# EAGLE design Baropodometro_V3 (EAGLE 9.6.0)

## Sheet 1 of 4
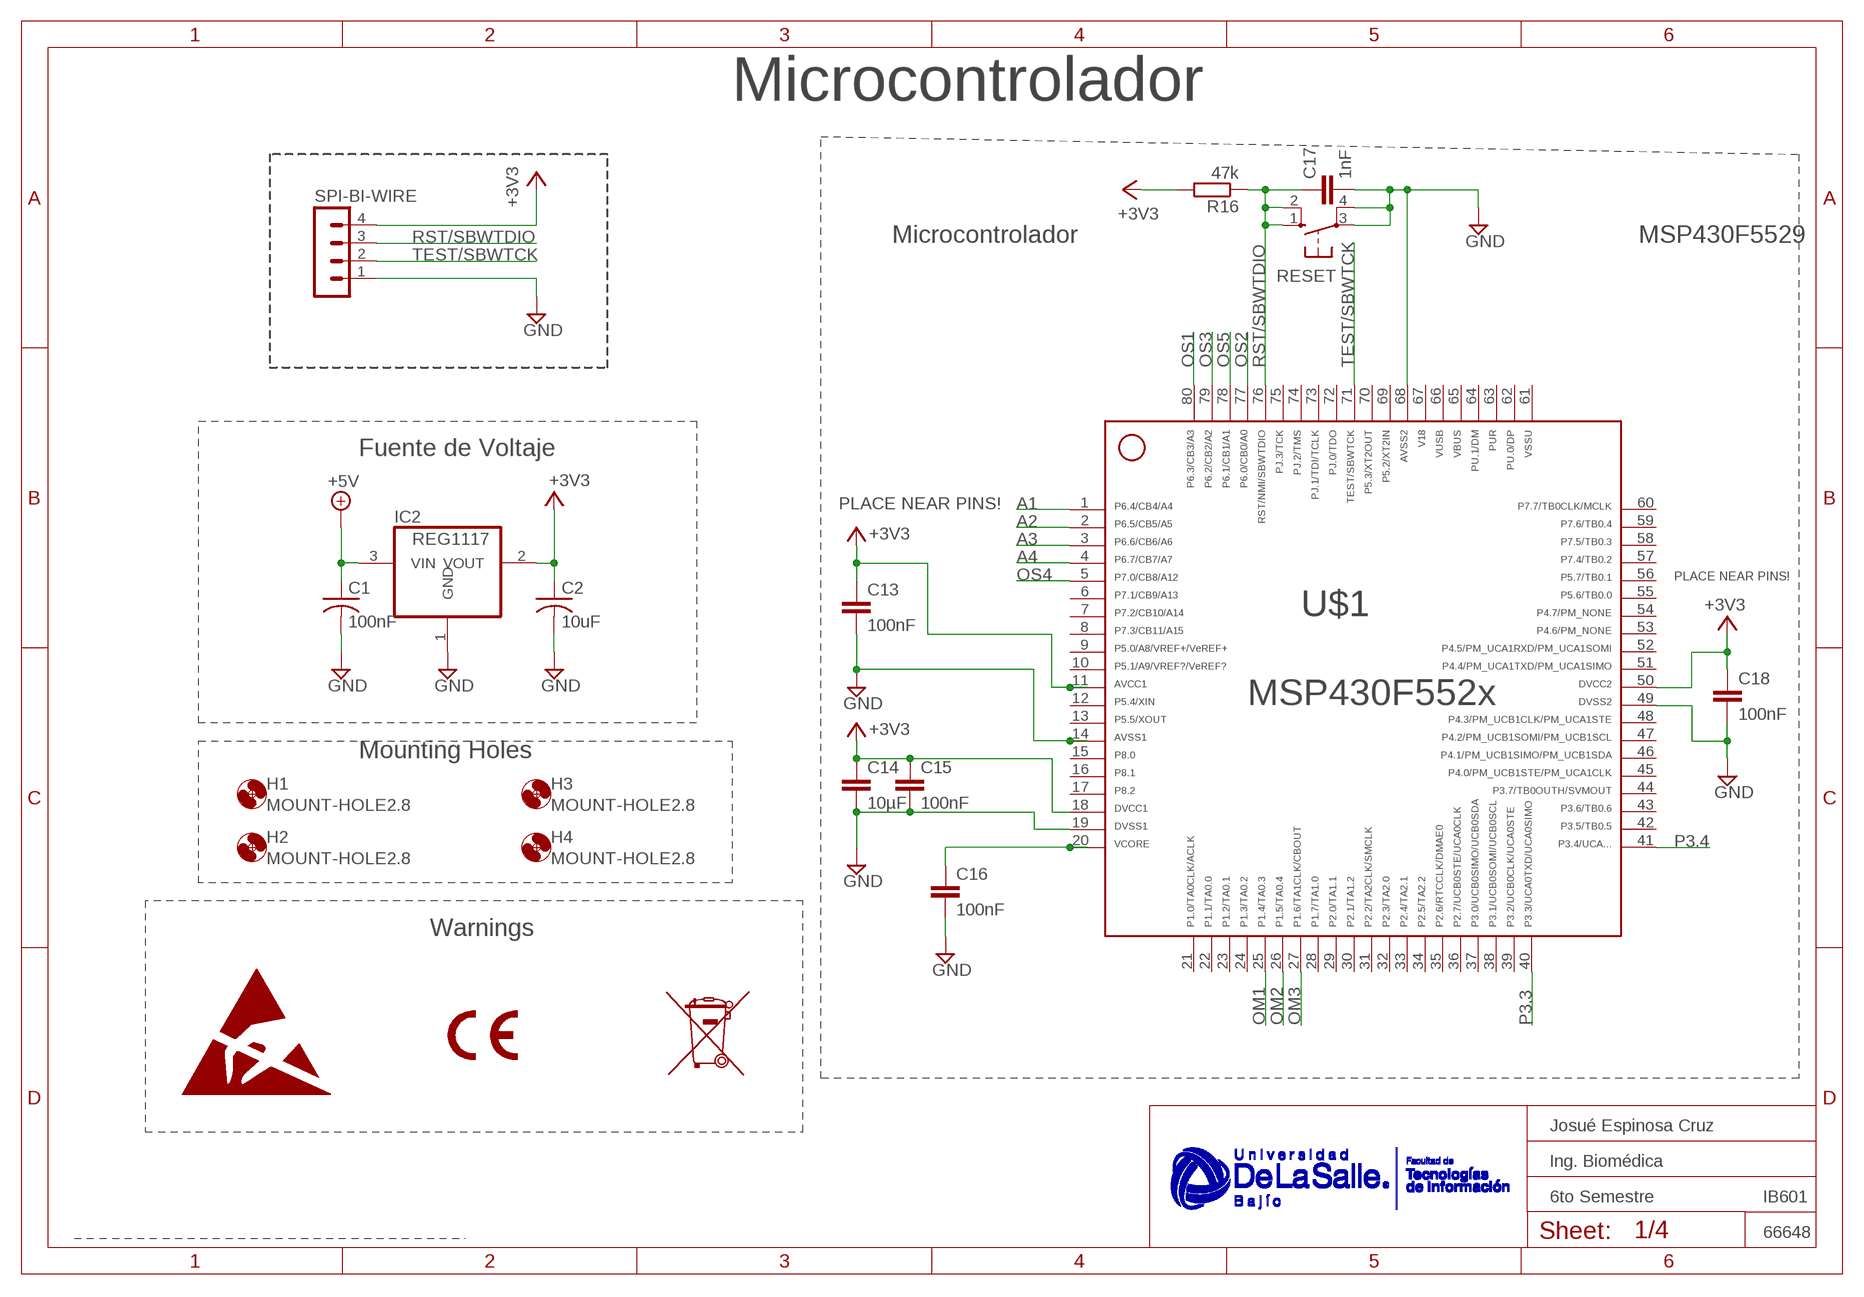
[diagram p0: schematic, sheet 1]

### Parts
C1  100nF  C-USC0805  [C0805]
C2  10uF  C-USC0805  [C0805]
C13  100nF  C-EUC0805  [C0805]
C14  10µF  C-EUC0805  [C0805]
C15  100nF  C-EUC0805  [C0805]
C16  100nF  C-EUC0805  [C0805]
C17  1nF  C-EUC0805  [C0805]
C18  100nF  C-EUC0805  [C0805]
H1  MOUNT-HOLE2.8  [2,8]
H2  MOUNT-HOLE2.8  [2,8]
H3  MOUNT-HOLE2.8  [2,8]
H4  MOUNT-HOLE2.8  [2,8]
IC2  REG1117  [SOT223]
R16  47k  R-EU_R0805  [R0805]
RESET  10-XX  [B3F-10XX]
SPI-BI-WIRE  MA04-1  [MA04-1]
U$1  MSP430F5529  TI_MSP430_V16_INTERN_F552X---PN80  [TI_MSP430_V16_INTERN_PN80]

### Nets
+3V3: C2.1 C13.1 C14.1 C15.1 C18.1 IC2.2(VOUT) R16.2 SPI-BI-WIRE.4 U$1.11 U$1.18 U$1.50 ; also sheet 2,3
+5V: C1.1 IC2.3(VIN) ; also sheet 4
A1: U$1.1 ; also sheet 3
A2: U$1.2 ; also sheet 3
A3: U$1.3 ; also sheet 3
A4: U$1.4 ; also sheet 3
GND: C1.2 C2.2 C13.2 C14.2 C15.2 C16.2 C17.2 C18.2 IC2.1(GND) RESET.3(P) RESET.4(P1) SPI-BI-WIRE.1 U$1.14 U$1.19 U$1.49 U$1.68 ; also sheet 2,3,4
N$5: C16.1 U$1.20
OM1: U$1.25 ; also sheet 3
OM2: U$1.26 ; also sheet 3
OM3: U$1.27 ; also sheet 3
OS1: U$1.80 ; also sheet 2
OS2: U$1.77 ; also sheet 2
OS3: U$1.79 ; also sheet 2
OS4: U$1.5 ; also sheet 2
OS5: U$1.78 ; also sheet 2
P3.3: U$1.40 ; also sheet 4
P3.4: U$1.41 ; also sheet 4
RST/SBWTDIO: C17.1 R16.1 RESET.1(S) RESET.2(S1) SPI-BI-WIRE.3 U$1.76
TEST/SBWTCK: SPI-BI-WIRE.2 U$1.71
Unconnected: U$1.6 U$1.7 U$1.8 U$1.9 U$1.10 U$1.12 U$1.13 U$1.15 U$1.16 U$1.17 U$1.21 U$1.22 U$1.23 U$1.24 U$1.28 U$1.29 U$1.30 U$1.31 U$1.32 U$1.33 U$1.34 U$1.35 U$1.36 U$1.37 U$1.38 U$1.39 U$1.42 U$1.43 U$1.44 U$1.45 U$1.46 U$1.47 U$1.48 U$1.51 U$1.52 U$1.53 U$1.54 U$1.55 U$1.56 U$1.57 U$1.58 U$1.59 U$1.60 U$1.62 U$1.63 U$1.64 U$1.69 U$1.70 U$1.72 U$1.73 U$1.74 U$1.75

### Notes on the sheet
- Microcontrolador
- Microcontrolador | MSP430F5529
- Fuente de Voltaje
- PLACE NEAR PINS!
- PLACE NEAR PINS!
- Mounting Holes
- Warnings

## Sheet 2 of 4
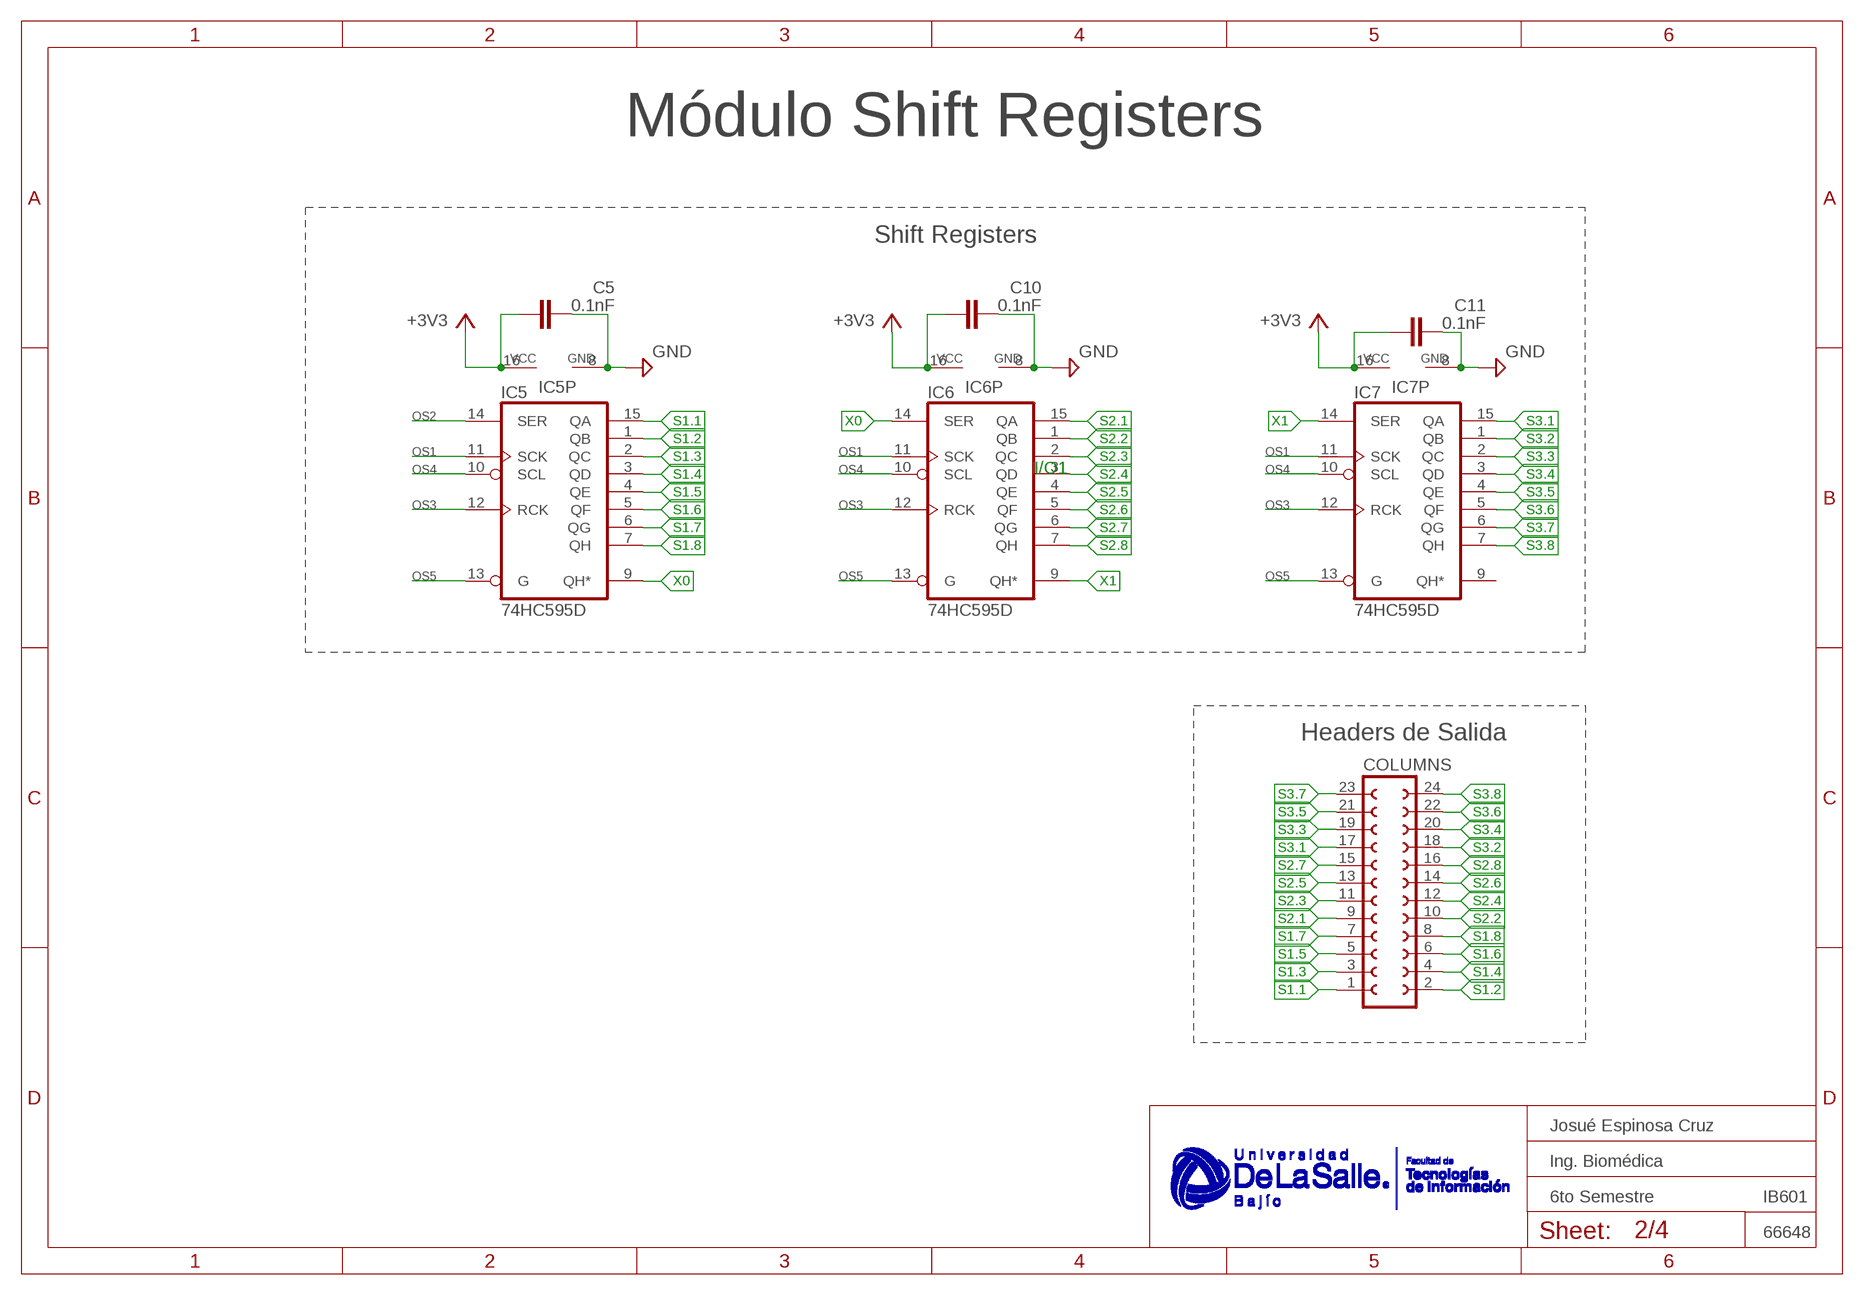
[diagram p1: schematic, sheet 2]

### Parts
C5  0.1nF  C-EUC0805  [C0805]
C10  0.1nF  C-EUC0805  [C0805]
C11  0.1nF  C-EUC0805  [C0805]
COLUMNS  FE12-2W  [FE12-2W]
IC5  74HC595D  [SO16]
IC6  74HC595D  [SO16]
IC7  74HC595D  [SO16]

### Nets
+3V3: C5.1 C10.1 C11.1 IC5.16(VCC) IC6.16(VCC) IC7.16(VCC) ; also sheet 1,3
GND: C5.2 C10.2 C11.2 IC5.8(GND) IC6.8(GND) IC7.8(GND) ; also sheet 1,3,4
OS1: IC5.11(SCK) IC6.11(SCK) IC7.11(SCK) ; also sheet 1
OS2: IC5.14(SER) ; also sheet 1
OS3: IC5.12(RCK) IC6.12(RCK) IC7.12(RCK) ; also sheet 1
OS4: IC5.10(SCL) IC6.10(SCL) IC7.10(SCL) ; also sheet 1
OS5: IC5.13(G) IC6.13(G) IC7.13(G) ; also sheet 1
S1.1: COLUMNS.1 IC5.15(QA)
S1.2: COLUMNS.2 IC5.1(QB)
S1.3: COLUMNS.3 IC5.2(QC)
S1.4: COLUMNS.4 IC5.3(QD)
S1.5: COLUMNS.5 IC5.4(QE)
S1.6: COLUMNS.6 IC5.5(QF)
S1.7: COLUMNS.7 IC5.6(QG)
S1.8: COLUMNS.8 IC5.7(QH)
S2.1: COLUMNS.9 IC6.15(QA)
S2.2: COLUMNS.10 IC6.1(QB)
S2.3: COLUMNS.11 IC6.2(QC)
S2.4: COLUMNS.12 IC6.3(QD)
S2.5: COLUMNS.13 IC6.4(QE)
S2.6: COLUMNS.14 IC6.5(QF)
S2.7: COLUMNS.15 IC6.6(QG)
S2.8: COLUMNS.16 IC6.7(QH)
S3.1: COLUMNS.17 IC7.15(QA)
S3.2: COLUMNS.18 IC7.1(QB)
S3.3: COLUMNS.19 IC7.2(QC)
S3.4: COLUMNS.20 IC7.3(QD)
S3.5: COLUMNS.21 IC7.4(QE)
S3.6: COLUMNS.22 IC7.5(QF)
S3.7: COLUMNS.23 IC7.6(QG)
S3.8: COLUMNS.24 IC7.7(QH)
X0: IC5.9(QH*) IC6.14(SER)
X1: IC6.9(QH*) IC7.14(SER)
Unconnected: IC7.9(QH*)

### Notes on the sheet
- Módulo Shift Registers
- Shift Registers
- I/O1
- Headers de Salida

## Sheet 3 of 4
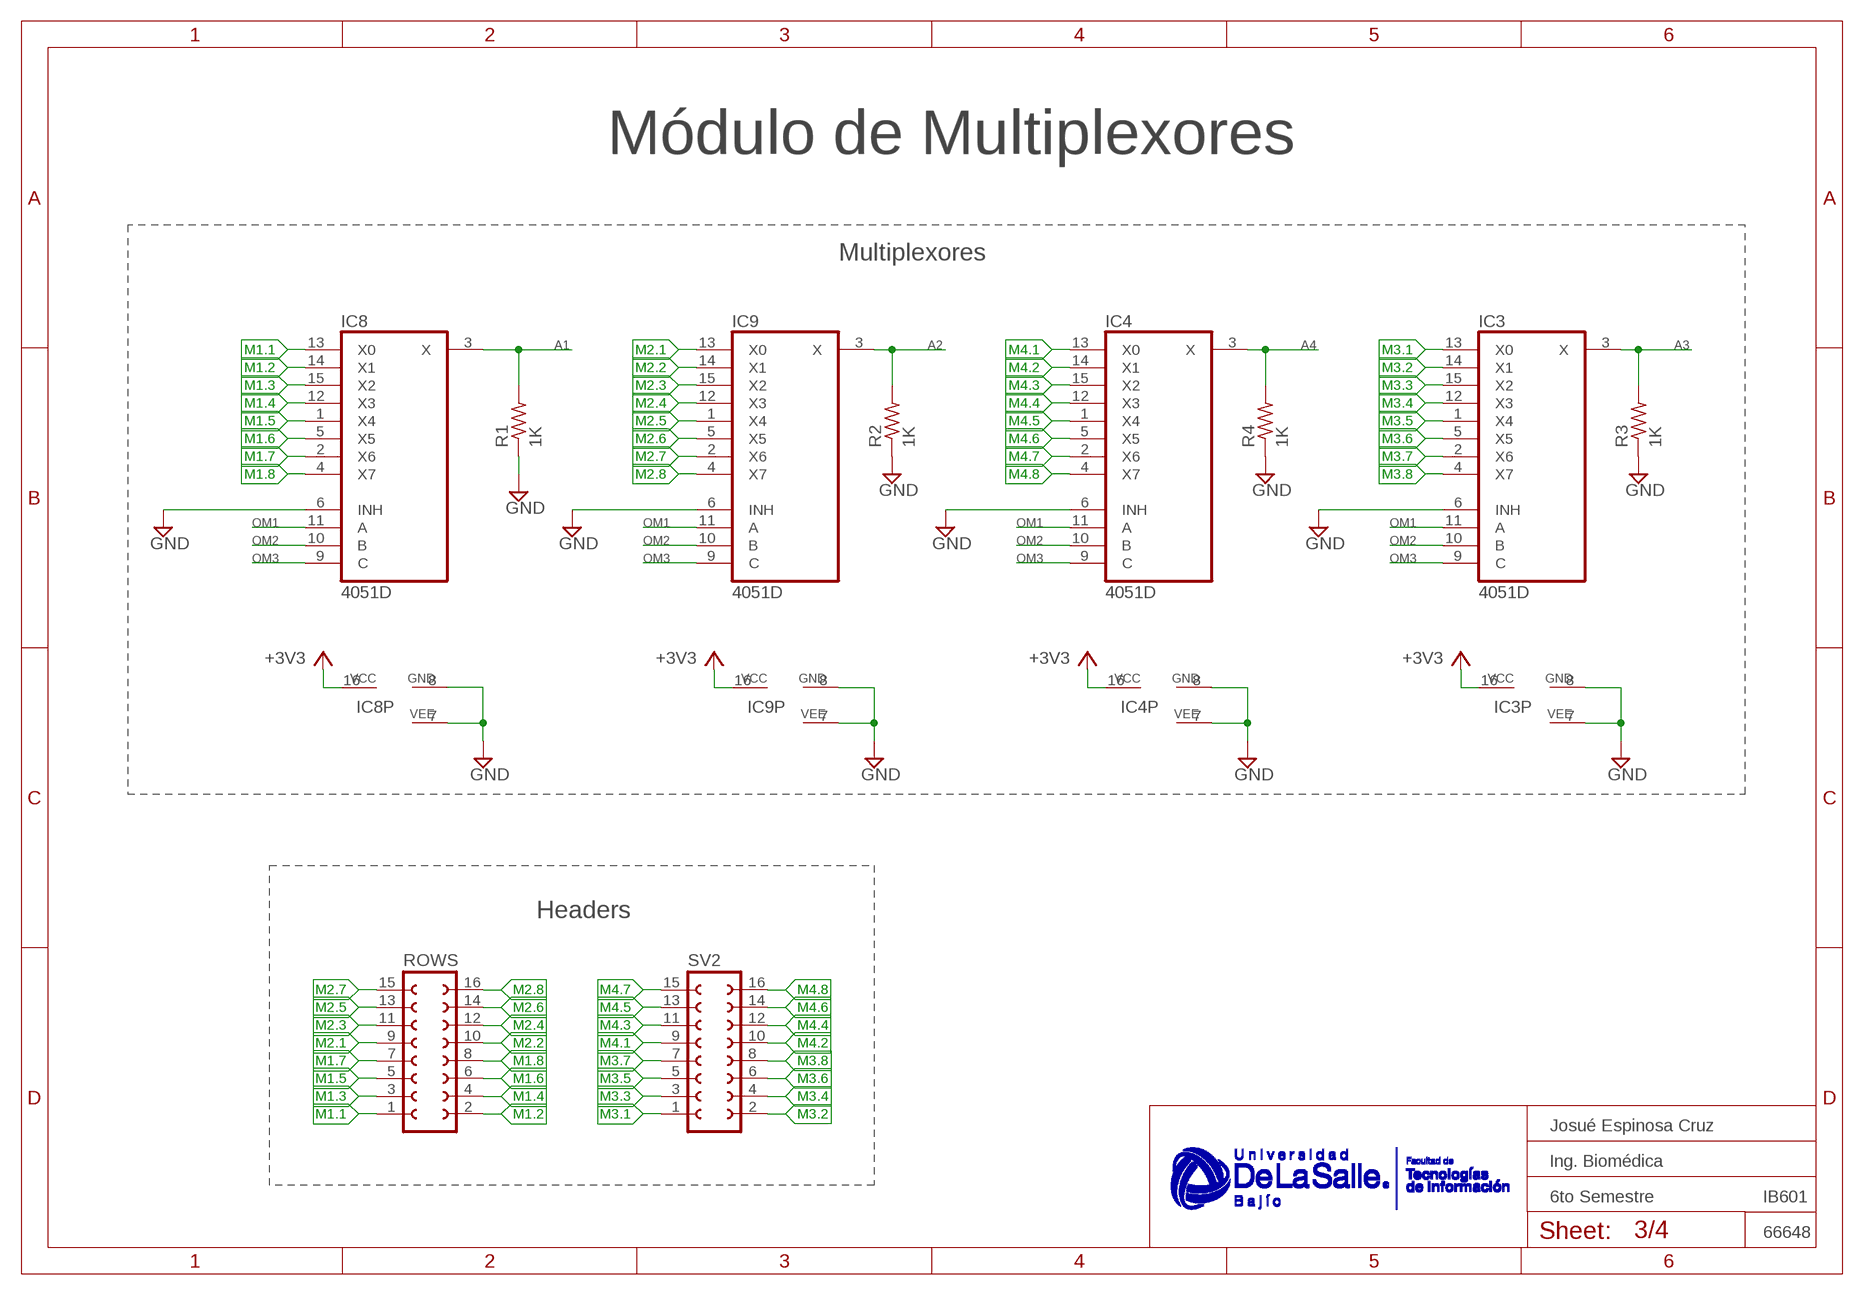
[diagram p2: schematic, sheet 3]

### Parts
IC3  4051D  [SO16]
IC4  4051D  [SO16]
IC8  4051D  [SO16]
IC9  4051D  [SO16]
R1  1K  R-US_R0805  [R0805]
R2  1K  R-US_R0805  [R0805]
R3  1K  R-US_R0805  [R0805]
R4  1K  R-US_R0805  [R0805]
ROWS  FE08-2W  [FE08-2W]
SV2  FE08-2W  [FE08-2W]

### Nets
+3V3: IC3.16(VCC) IC4.16(VCC) IC8.16(VCC) IC9.16(VCC) ; also sheet 1,2
A1: IC8.3(X) R1.2 ; also sheet 1
A2: IC9.3(X) R2.2 ; also sheet 1
A3: IC3.3(X) R3.2 ; also sheet 1
A4: IC4.3(X) R4.2 ; also sheet 1
GND: IC3.6(INH) IC3.7(VEE) IC3.8(GND) IC4.6(INH) IC4.7(VEE) IC4.8(GND) IC8.6(INH) IC8.7(VEE) IC8.8(GND) IC9.6(INH) IC9.7(VEE) IC9.8(GND) R1.1 R2.1 R3.1 R4.1 ; also sheet 1,2,4
M1.1: IC8.13(X0) ROWS.1
M1.2: IC8.14(X1) ROWS.2
M1.3: IC8.15(X2) ROWS.3
M1.4: IC8.12(X3) ROWS.4
M1.5: IC8.1(X4) ROWS.5
M1.6: IC8.5(X5) ROWS.6
M1.7: IC8.2(X6) ROWS.7
M1.8: IC8.4(X7) ROWS.8
M2.1: IC9.13(X0) ROWS.9
M2.2: IC9.14(X1) ROWS.10
M2.3: IC9.15(X2) ROWS.11
M2.4: IC9.12(X3) ROWS.12
M2.5: IC9.1(X4) ROWS.13
M2.6: IC9.5(X5) ROWS.14
M2.7: IC9.2(X6) ROWS.15
M2.8: IC9.4(X7) ROWS.16
M3.1: IC3.13(X0) SV2.1
M3.2: IC3.14(X1) SV2.2
M3.3: IC3.15(X2) SV2.3
M3.4: IC3.12(X3) SV2.4
M3.5: IC3.1(X4) SV2.5
M3.6: IC3.5(X5) SV2.6
M3.7: IC3.2(X6) SV2.7
M3.8: IC3.4(X7) SV2.8
M4.1: IC4.13(X0) SV2.9
M4.2: IC4.14(X1) SV2.10
M4.3: IC4.15(X2) SV2.11
M4.4: IC4.12(X3) SV2.12
M4.5: IC4.1(X4) SV2.13
M4.6: IC4.5(X5) SV2.14
M4.7: IC4.2(X6) SV2.15
M4.8: IC4.4(X7) SV2.16
OM1: IC3.11(A) IC4.11(A) IC8.11(A) IC9.11(A) ; also sheet 1
OM2: IC3.10(B) IC4.10(B) IC8.10(B) IC9.10(B) ; also sheet 1
OM3: IC3.9(C) IC4.9(C) IC8.9(C) IC9.9(C) ; also sheet 1

### Notes on the sheet
- Módulo de Multiplexores
- Multiplexores
- Headers

## Sheet 4 of 4
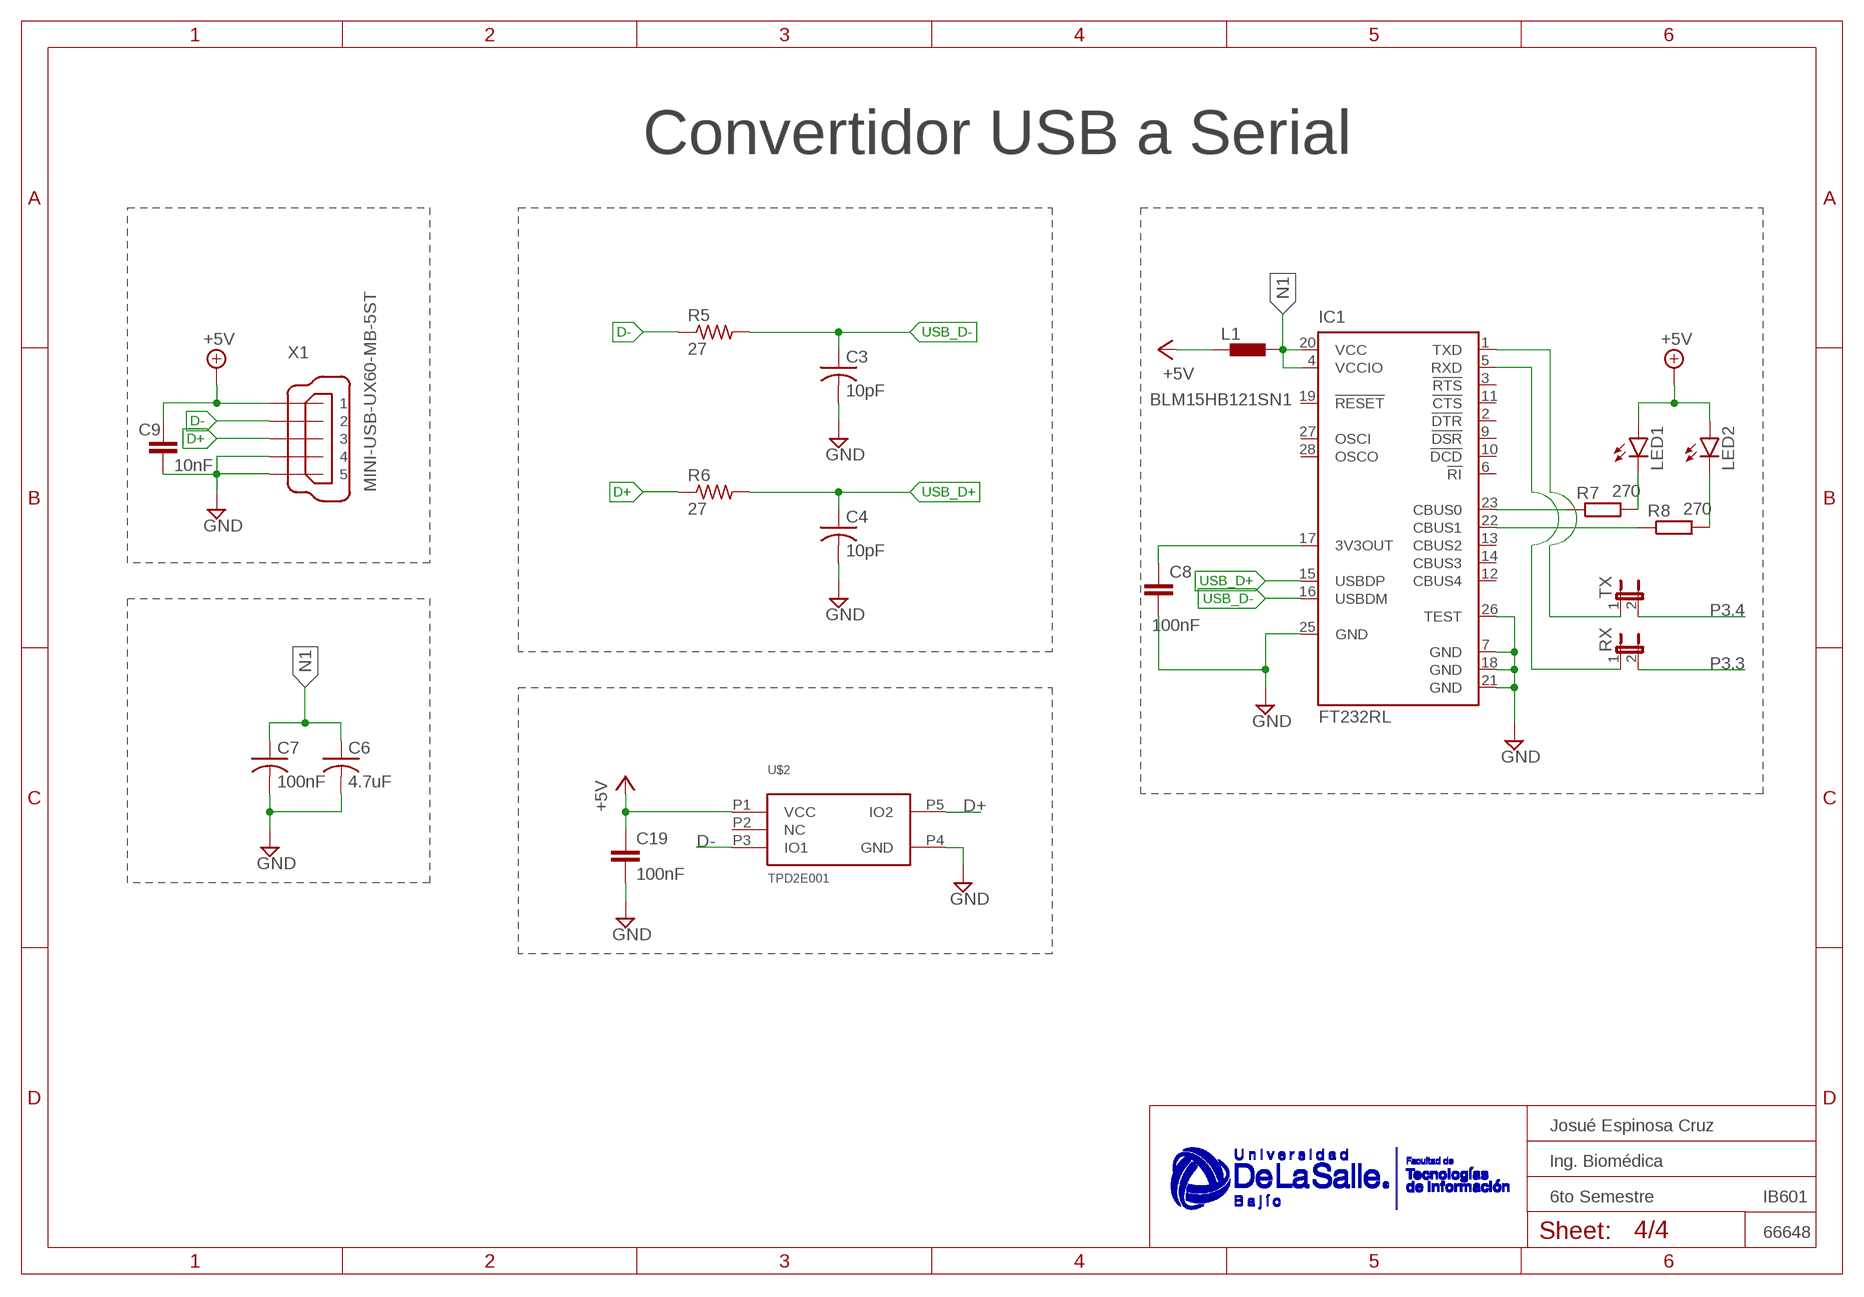
[diagram p3: schematic, sheet 4]

### Parts
C3  10pF  C-USC0805  [C0805]
C4  10pF  C-USC0805  [C0805]
C6  4.7uF  C-USC0805  [C0805]
C7  100nF  C-USC0805  [C0805]
C8  100nF  C-EUC0805  [C0805]
C9  10nF  C-EUC0805  [C0805]
C19  100nF  C-EUC0805  [C0805]
IC1  FT232RL  [SSOP28]
L1  BLM15HB121SN1  [0402]
LED1  LEDCHIP-LED0805  [CHIP-LED0805]
LED2  LEDCHIP-LED0805  [CHIP-LED0805]
R5  27  R-US_R0805  [R0805]
R6  27  R-US_R0805  [R0805]
R7  270  R-EU_R0805  [R0805]
R8  270  R-EU_R0805  [R0805]
RX  JP1E  [JP1]
TX  JP1E  [JP1]
U$2  TPD2E001  [SOT-5]
X1  MINI-USB-UX60-MB-5ST  [UX60-MB-5ST]

### Nets
+5V: C9.1 C19.1 L1.1 LED1.A LED2.A U$2.P1(VCC) X1.1 ; also sheet 1
D+: R6.1 U$2.P5(IO2) X1.3
D-: R5.1 U$2.P3(IO1) X1.2
GND: C3.2 C4.2 C6.2 C7.2 C8.2 C9.2 C19.2 IC1.7(GND) IC1.18(GND) IC1.21(GND) IC1.25(GND) IC1.26(TEST) U$2.P4(GND) X1.4 X1.5 ; also sheet 1,2,3
N1: C6.1 C7.1 IC1.4(VCCIO) IC1.20(VCC) L1.2
N$2: LED1.C R7.2
N$3: IC1.22(CBUS1) R8.1
N$6: IC1.23(CBUS0) R7.1
N$7: LED2.C R8.2
N$9: IC1.1(TXD) TX.1
N$10: IC1.5(RXD) RX.1
N$11: C8.1 IC1.17(3V3OUT)
P3.3: RX.2 ; also sheet 1
P3.4: TX.2 ; also sheet 1
USB_D+: C4.1 IC1.15(USBDP) R6.2
USB_D-: C3.1 IC1.16(USBDM) R5.2
Unconnected: IC1.2(!DTR) IC1.3(!RTS) IC1.6(!RI) IC1.9(!DSR) IC1.10(!DCD) IC1.11(!CTS) IC1.12(CBUS4) IC1.13(CBUS2) IC1.14(CBUS3) IC1.19(!RESET) IC1.27(OSCI) IC1.28(OSCO) U$2.P2(NC)

### Notes on the sheet
- Convertidor USB a Serial

## Power pins joined to a net without a drawn wire
61: U$1.61
65: U$1.65
66: U$1.66
67: U$1.67

## Library data of the parts
C1-C4 C6 C7 = rcl:C-US: CAPACITOR, American symbol; SPICEPREFIX: C
C5 C8-C11 C13-C19 = rcl:C-EU: CAPACITOR, European symbol; SPICEPREFIX: C
COLUMNS = Baropodometro:FE12-2W: FEMALE HEADER; OC_FARNELL: unknown; OC_NEWARK: unknown
H1-H4 = Baropodometro:MOUNT-HOLE: MOUNTING HOLE with drill center marker
IC1 = Baropodometro:FT232R: Source: http://www.ftdichip.com/Documents/DataSheets/DS_FT232R_v104.pdf; MPN: FT232RL; OC_FARNELL: 1146032; OC_NEWARK: 91K9918
IC2 = Baropodometro:REG1117: 800mA and 1A Low Dropout (LDO) Positive Regulator 1.8V, 2.5V, 2.85V, 3.3V, 5V, and Adj; MPN: REG1117; OC_FARNELL: 1097566; OC_NEWARK: 14P6981
IC3 IC4 IC8 IC9 = Baropodometro:4051: 8-channel ANALOG MULTIPLEXER
IC5-IC7 = Baropodometro:74*595: 8-bit SHIFT REGISTER, output latch
L1 = inductors:BLM15H: EMIFIL (R) Chip Ferrite Bead for GHz Noise Source: http://www.murata.com/ Ferrite Bead BLM15H.pdf
LED1 LED2 = led:LED: LED OSRAM: - CHIPLED LG R971, LG N971, LY N971, LG Q971, LY Q971, LO R971, LY R971 LH N974, LH R974 LS Q976, LO Q976, LY Q976 LO Q996 - Hyper CHIPLED LW Q18S LB Q993, LB Q99A, LB R99A - SideLED LS A670, LO A670, LY A670, LG A670, LP A670 LB A673, LV A673, LT A673, LW A673 LH A674 LY A675 LS A676, LA A676, LO A676, LY A676, LW A676 LS A679, LY A679, LG A679 - Hyper Micro SIDELED® LS Y876, LA Y876, LO Y876, LY Y876 LT Y87S - SmartLED LW L88C, LW L88S LB L89C, LB L89S, LG L890 LS L89K, LO L89K, LY L89K LS L896, LA L896, LO L896, LY L896 - TOPLED LS T670, LO T670, LY T670, LG T670, LP T670 LSG T670, LSP T670, LSY T670, LOP T670, LYG T670 LG T671, LOG T671, LSG T671 LB T673, LV T673, LT T673, LW T673 LH T674 LS T676, LA T676, LO T676, LY T676, LB T676, LH T676, LSB T676, LW T676 LB T67C, LV T67C, LT T67C, LS T67K, LO T67K, LY T67K, LW E67C LS E67B, LA E67B, LO E67B, LY E67B, LB E67C, LV E67C, LT E67C LW T67C LS T679, LY T679, LG T679 LS T770, LO T770, LY T770, LG T770, LP T770 LB T773, LV T773, LT T773, LW T773 LH T774 LS E675, LA E675, LY E675, LS T675 LS T776, LA T776, LO T776, LY T776, LB T776 LHGB T686 LT T68C, LB T68C - Hyper Mini TOPLED® LB M676 - Mini TOPLED Santana® LG M470 LS M47K, LO M47K, LY M47K Source: http://www.osram.convergy.de LUXEON: - LUMILED® LXK2-PW12-R00, LXK2-PW12-S00, LXK2-PW14-U00, LXK2-PW14-V00 LXK2-PM12-R00, LXK2-PM12-S00, LXK2-PM14-U00 LXK2-PE12-Q00, LXK2-PE12-R00, LXK2-PE12-S00, LXK2-PE14-T00, LXK2-PE14-U00 LXK2-PB12-K00, LXK2-PB12-L00, LXK2-PB12-M00, LXK2-PB14-N00, LXK2-PB14-P00, LXK2-PB14-Q00 LXK2-PR12-L00, LXK2-PR12-M00, LXK2-PR14-Q00, LXK2-PR14-R00 LXK2-PD12-Q00, LXK2-PD12-R00, LXK2-PD12-S00 LXK2-PH12-R00, LXK2-PH12-S00 LXK2-PL12-P00, LXK2-PL12-Q00, LXK2-PL12-R00 Source: www.luxeon.com KINGBRIGHT: KA-3528ASYC Source: www.kingbright.com
R1-R6 = rcl:R-US_: RESISTOR, American symbol; SPICEPREFIX: R
R7 R8 R16 = rcl:R-EU_: RESISTOR, European symbol; SPICEPREFIX: R
RESET = Baropodometro:10-XX: OMRON SWITCH; MPN: B3F-1000; OC_FARNELL: 176432; OC_NEWARK: 36M3542
ROWS SV2 = Baropodometro:FE08-2W: FEMALE HEADER; OC_FARNELL: unknown; OC_NEWARK: unknown
RX TX = Baropodometro:JP1E: JUMPER
SPI-BI-WIRE = Baropodometro:MA04-1: PIN HEADER; OC_FARNELL: unknown; OC_NEWARK: unknown
U$1 = Baropodometro:TI_MSP430_V16_INTERN_F552X---PN80: ***MSP430F552X***PN80 http://www.ti.com/lit/gpn/msp430f5529 Rev1.0 06/2010 For F552X where X is 1,5,7,9
U$2 = Baropodometro:TPD2E001
X1 = Baropodometro:MINI-USB-: MINI USB Connector Source: http://www.hirose.co.jp/cataloge_hp/e24000019.pdf; OC_FARNELL: unknown; OC_NEWARK: unknown

## Board
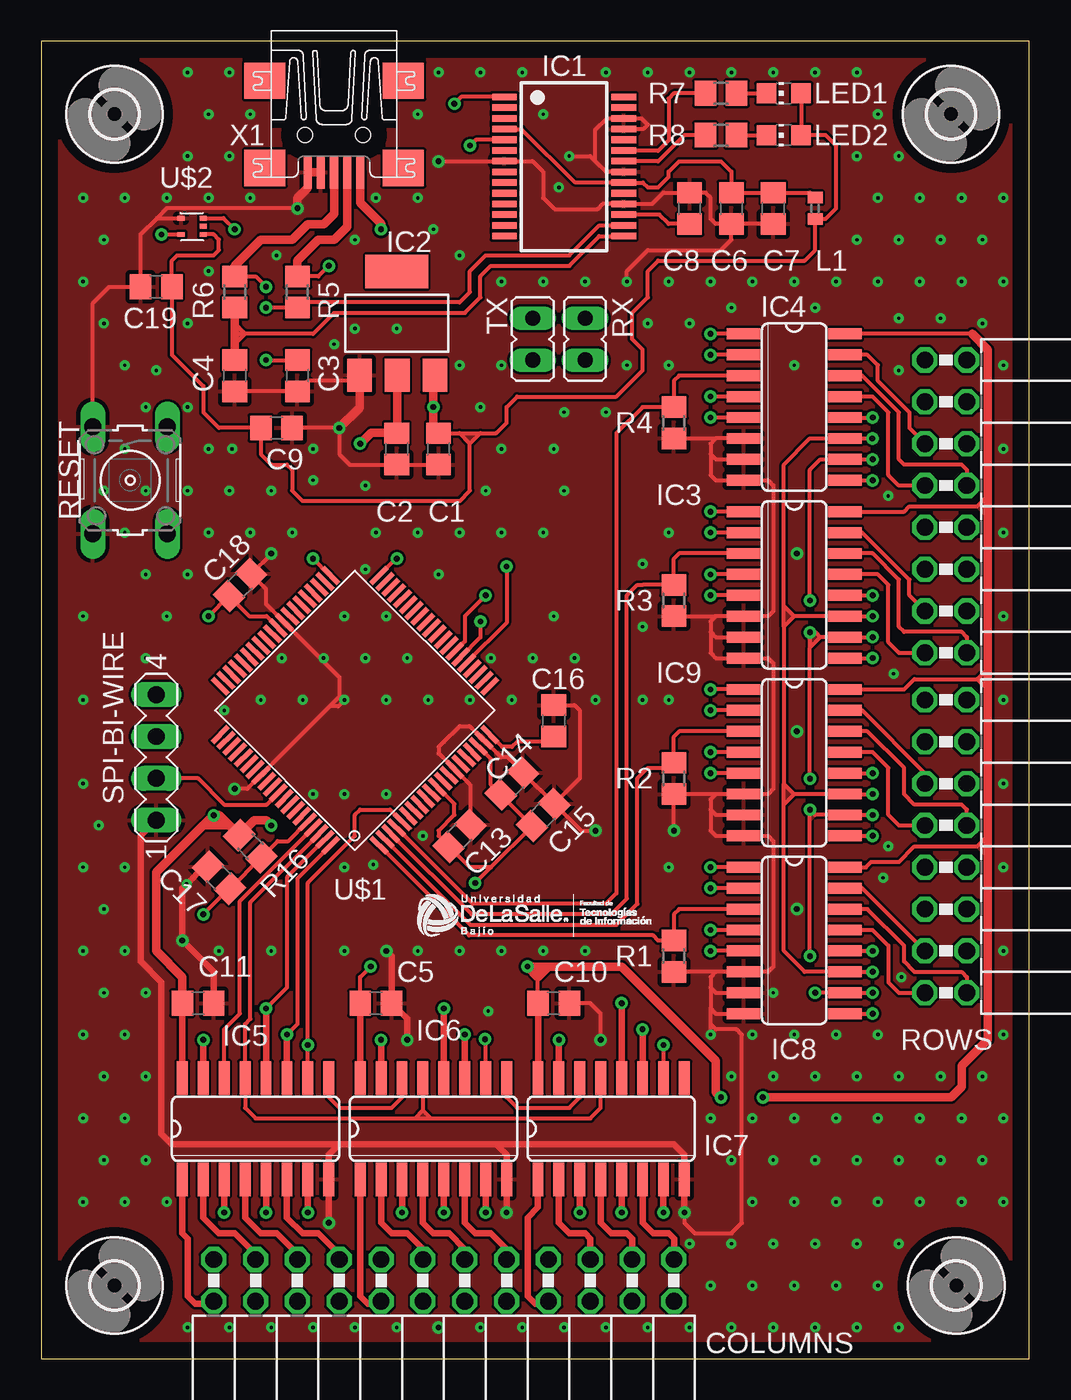
[diagram p4: board, top side]
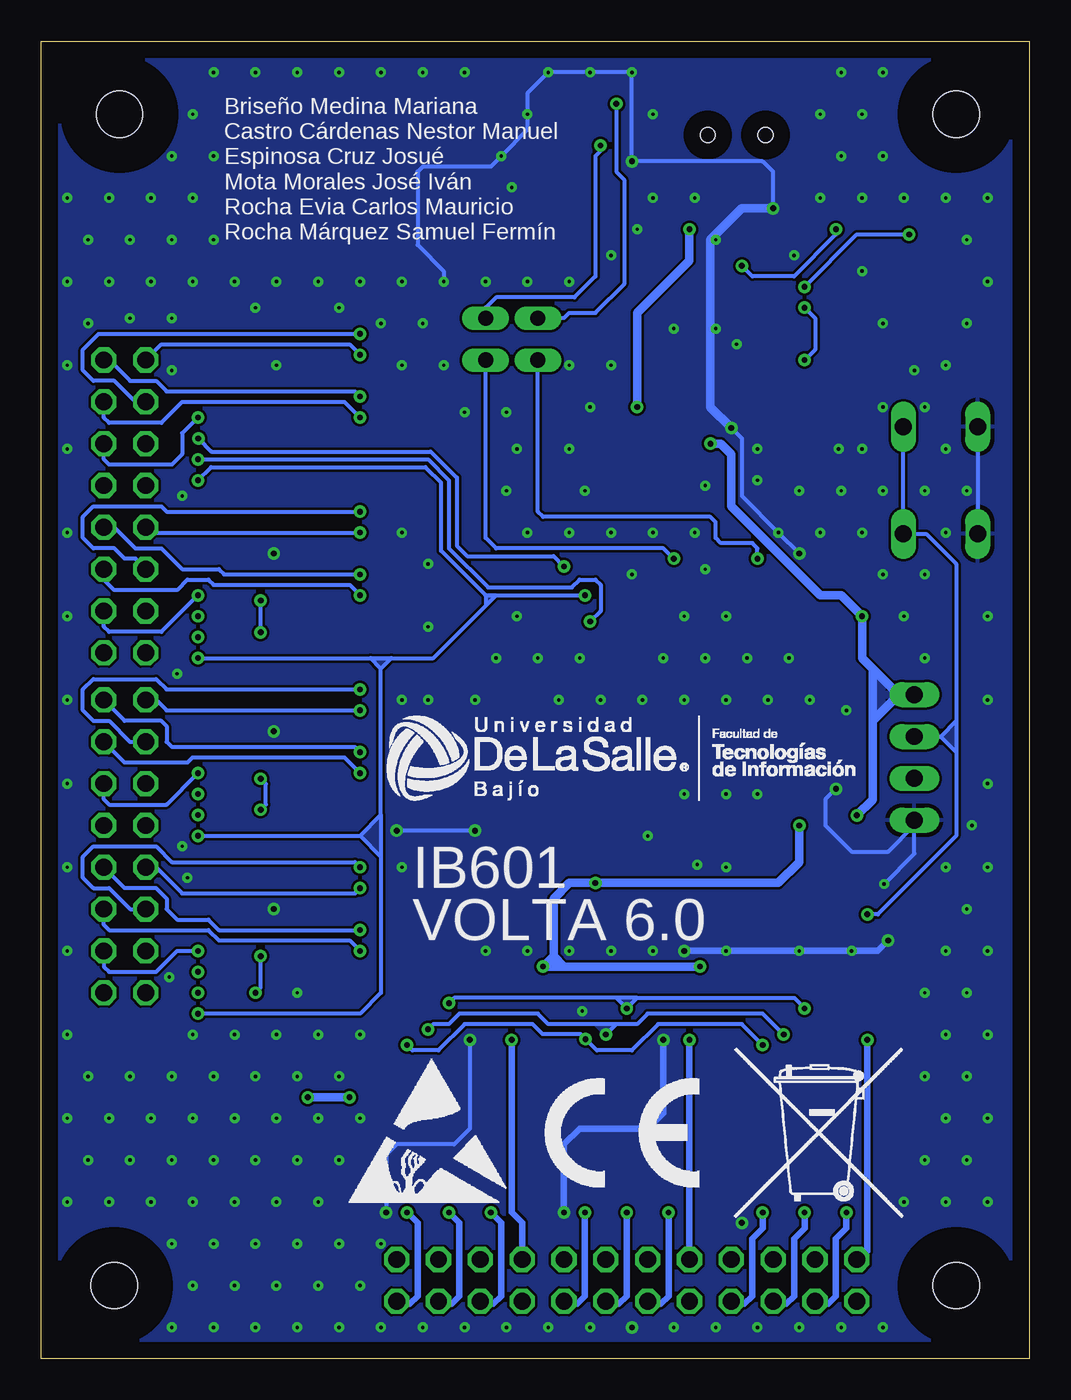
[diagram p5: board, bottom side, seen from below]

Size 60 x 80 mm. Coordinates in mm from the lower left corner, seen from the top.
Outline: 0,0 60,0 60,80 0,80 0,0
Copper layers (1*16): Top 0.035mm / dielectric 1.5mm / Bottom 0.035mm
Design rules "default *": minimum track width 6mil, minimum drill 0.2mm, track to track 6mil, track to pad 6mil, pad to pad 6mil, via to via 8mil, smd to smd 6mil, copper to edge 40mil, drill to drill 6mil, minimum pad ring 10mil, minimum via ring 8mil, stop-mask expansion 4mil, vias tented up to drill 0mil, thermal gap 10mil

### Footprints (pad centres in the part's own frame; a part is rotated, then mirrored left to right if it is on the bottom)
C0805 = smd 1.3 x 1.5: 1 -0.95,0; 2 0.95,0
FE12-2W = drill 1.016 octagon: 1 -13.97,1.27; 2 -13.97,-1.27; 3 -11.43,1.27; 4 -11.43,-1.27; 5 -8.89,1.27; 6 -8.89,-1.27; 7 -6.35,1.27; 8 -6.35,-1.27; 9 -3.81,1.27; 10 -3.81,-1.27; 11 -1.27,1.27; 12 -1.27,-1.27; 13 1.27,1.27; 14 1.27,-1.27; 15 3.81,1.27; 16 3.81,-1.27; 17 6.35,1.27; 18 6.35,-1.27; 19 8.89,1.27; 20 8.89,-1.27; 21 11.43,1.27; 22 11.43,-1.27; 23 13.97,1.27; 24 13.97,-1.27
2,8 = hole 2.8: 0,0
SSOP28 = smd 0.4 x 1.5: 1 -4.225,-3.625; 2 -3.575,-3.625; 3 -2.925,-3.625; 4 -2.275,-3.625; 5 -1.625,-3.625; 6 -0.975,-3.625; 7 -0.325,-3.625; 8 0.325,-3.625; 9 0.975,-3.625; 10 1.625,-3.625; 11 2.275,-3.625; 12 2.925,-3.625; 13 3.575,-3.625; 14 4.225,-3.625; 15 4.225,3.625; 16 3.575,3.625; 17 2.925,3.625; 18 2.275,3.625; 19 1.625,3.625; 20 0.975,3.625; 21 0.325,3.625; 22 -0.325,3.625; 23 -0.975,3.625; 24 -1.625,3.625; 25 -2.275,3.625; 26 -2.925,3.625; 27 -3.575,3.625; 28 -4.225,3.625
SOT223 = smd 1.499 x 2.007: 1 -2.261,-3.15; 2 0.025,-3.15; 3 2.311,-3.15 | smd 3.81 x 2.007: 4 0,3.15
SO16 = smd 0.66 x 2.032: 1 -4.445,-3.073; 2 -3.175,-3.073; 3 -1.905,-3.073; 4 -0.635,-3.073; 5 0.635,-3.073; 6 1.905,-3.073; 7 3.175,-3.073; 8 4.445,-3.073; 9 4.445,3.073; 10 3.175,3.073; 11 1.905,3.073; 12 0.635,3.073; 13 -0.635,3.073; 14 -1.905,3.073; 15 -3.175,3.073; 16 -4.445,3.073
0402 = smd 0.7 x 0.9: 1 -0.65,0; 2 0.65,0
CHIP-LED0805 = smd 1.2 x 1.2: A 0,-1.05; C 0,1.05
R0805 = smd 1.3 x 1.5: 1 -0.95,0; 2 0.95,0
B3F-10XX = drill 1.016 long: 1 -3.251,2.261; 2 3.251,2.261; 3 -3.251,-2.261; 4 3.251,-2.261
FE08-2W = drill 1.016 octagon: 1 -8.89,1.27; 2 -8.89,-1.27; 3 -6.35,1.27; 4 -6.35,-1.27; 5 -3.81,1.27; 6 -3.81,-1.27; 7 -1.27,1.27; 8 -1.27,-1.27; 9 1.27,1.27; 10 1.27,-1.27; 11 3.81,1.27; 12 3.81,-1.27; 13 6.35,1.27; 14 6.35,-1.27; 15 8.89,1.27; 16 8.89,-1.27
JP1 = drill 0.914 long: 1 0,-1.27; 2 0,1.27
MA04-1 = drill 1.016 long: 1 -3.81,0; 2 -1.27,0; 3 1.27,0; 4 3.81,0
TI_MSP430_V16_INTERN_PN80 = smd 1.35 x 0.3: 1 -6.825,4.75; 2 -6.825,4.25; 3 -6.825,3.75; 4 -6.825,3.25; 5 -6.825,2.75; 6 -6.825,2.25; 7 -6.825,1.75; 8 -6.825,1.25; 9 -6.825,0.75; 10 -6.825,0.25; 11 -6.825,-0.25; 12 -6.825,-0.75; 13 -6.825,-1.25; 14 -6.825,-1.75; 15 -6.825,-2.25; 16 -6.825,-2.75; 17 -6.825,-3.25; 18 -6.825,-3.75; 19 -6.825,-4.25; 20 -6.825,-4.75; 41 6.825,-4.75; 42 6.825,-4.25; 43 6.825,-3.75; 44 6.825,-3.25; 45 6.825,-2.75; 46 6.825,-2.25; 47 6.825,-1.75; 48 6.825,-1.25; 49 6.825,-0.75; 50 6.825,-0.25; 51 6.825,0.25; 52 6.825,0.75; 53 6.825,1.25; 54 6.825,1.75; 55 6.825,2.25; 56 6.825,2.75; 57 6.825,3.25; 58 6.825,3.75; 59 6.825,4.25; 60 6.825,4.75 | smd 0.3 x 1.35: 21 -4.75,-6.825; 22 -4.25,-6.825; 23 -3.75,-6.825; 24 -3.25,-6.825; 25 -2.75,-6.825; 26 -2.25,-6.825; 27 -1.75,-6.825; 28 -1.25,-6.825; 29 -0.75,-6.825; 30 -0.25,-6.825; 31 0.25,-6.825; 32 0.75,-6.825; 33 1.25,-6.825; 34 1.75,-6.825; 35 2.25,-6.825; 36 2.75,-6.825; 37 3.25,-6.825; 38 3.75,-6.825; 39 4.25,-6.825; 40 4.75,-6.825; 61 4.75,6.825; 62 4.25,6.825; 63 3.75,6.825; 64 3.25,6.825; 65 2.75,6.825; 66 2.25,6.825; 67 1.75,6.825; 68 1.25,6.825; 69 0.75,6.825; 70 0.25,6.825; 71 -0.25,6.825; 72 -0.75,6.825; 73 -1.25,6.825; 74 -1.75,6.825; 75 -2.25,6.825; 76 -2.75,6.825; 77 -3.25,6.825; 78 -3.75,6.825; 79 -4.25,6.825; 80 -4.75,6.825
SOT-5 = smd 0.45 x 0.3: P1 0,0; P2 0,-0.5; P3 0,-1; P4 1.35,-1; P5 1.35,0
UX60-MB-5ST = smd 2 x 0.5: 1 2.25,1.6; 2 2.25,0.8; 3 2.25,0; 4 2.25,-0.8; 5 2.25,-1.6 | smd 2.2 x 2.5: M1 -3.3,-4.2; M2 -3.3,4.2; M3 2,4.2; M4 2,-4.2 | hole 0.9: 0,-1.75; 0,1.75

### Placement (x,y rotation side)
C1  24.13,55.24 270 top
C2  21.59,55.24 270 top
C3  15.56,59.69 270 top
C4  11.75,59.69 270 top
C5  20.32,21.59 0 top
C6  41.91,69.85 270 top
C7  44.45,69.85 270 top
C8  39.37,69.85 90 top
C9  14.29,56.52 0 top
C10  31.11,21.59 0 top
C11  9.53,21.59 0 top
C13  25.4,31.75 45 top
C14  28.57,34.92 45 top
C15  30.48,33.02 45 top
C16  31.11,38.73 90 top
C17  10.79,29.21 135 top
C18  12.06,46.99 45 top
C19  6.99,65.09 180 top
COLUMNS  24.45,4.76 0 top
H1  55.56,4.45 0 top
H2  4.45,4.45 0 top
H3  4.45,75.56 0 top
H4  55.24,75.56 0 top
IC1  31.75,72.39 270 top
IC2  21.59,62.87 0 top
IC3  45.72,46.99 270 top
IC4  45.72,57.78 270 top
IC5  13.02,13.97 0 top
IC6  23.81,13.97 0 top
IC7  34.61,13.97 0 top
IC8  45.72,25.4 270 top
IC9  45.72,36.2 270 top
L1  46.99,69.85 90 top
LED1  45.09,76.83 90 top
LED2  45.09,74.3 90 top
R1  38.42,24.45 90 top
R2  38.42,35.24 90 top
R3  38.42,46.04 90 top
R4  38.42,56.83 90 top
R5  15.56,64.77 270 top
R6  11.75,64.77 270 top
R7  41.27,76.83 0 top
R8  41.27,74.3 0 top
R16  12.7,31.11 135 top
RESET  5.4,53.34 270 top
ROWS  54.93,31.11 90 top
RX  33.02,61.91 180 top
SPI-BI-WIRE  6.99,36.51 90 top
SV2  54.93,51.75 90 top
TX  29.84,61.91 180 top
U$1  19.05,39.37 135 top
U$2  9.84,68.26 180 top
X1  17.78,74.3 270 top

### Tracks (layer width: path | path; a pad name or v marks a point on that pad's centre or on a via)
+3V3  (via drill 0.35)
  Top 0.254: IC5.16 | C5.1 19.37,23.18 v20,23.81 | C10.1 30.16,23.18 | 56.52,62.23 IC4.16 | IC3.16 52.39,51.44 52.7,51.75 56.83,51.75 57.47,52.39 | IC9.16 52.39,40.64 53.02,41.27 56.83,41.27 | IC8.16 50.06,29.84 50.38,30.16 52.07,30.16 53.02,31.11 56.83,31.11 57.47,31.75 | U$1.18 27.3,36.42 27.3,34.85 C14.1 C15.1 27.3,29.84 | U$1.50 13.69,45.09 12.63,45.09 C18.1 v10.16,45.09 | 27.3,29.84 26.04,29.84 24.73,31.15 | 27.3,29.84 v26.35,28.89 | 24.73,31.15 C13.1 | 24.73,31.15 24.13,31.75 24.13,32.07 25.08,33.02 25.08,33.69 U$1.11 | 57.47,41.91 56.83,41.27 | 56.83,41.27 57.47,40.64
  Top 0.406: C11.1 IC5.16 | C5.1 IC6.16 | C10.1 IC7.16
  Top 0.508: 56.52,62.23 57.47,61.28 57.47,52.39 57.47,41.91 57.47,40.64 57.47,31.75 57.47,19.37 55.88,17.78 55.88,16.51 55.24,15.88 v43.81,15.88 | 30.8,23.81 35.24,23.81 40.96,18.1 40.96,16.19 v41.27,15.88 | IC2.2 21.61,56.22 | 21.61,56.22 C2.1 | v13.97,32.38 13.65,32.7 12.94,32.7 R16.2 11.43,32.38 | 21.61,56.22 20.02,56.22 v19.37,55.56 | C11.1 8.57,23.18 6.99,24.77 6.99,29.53 9.84,32.38 9.87,32.38 | 30.8,23.81 30.16,23.18 v29.53,23.81 30.8,23.81 | 9.87,32.38 11.43,32.38 | 9.87,32.38 v10.48,33 10.82,33 11.43,32.38
  Bottom 0.508: v20,23.81 28.26,23.81 | v43.81,15.88 v41.27,15.88 | v13.97,32.38 13.97,30.16 15.24,28.89 v26.35,28.89 27.94,28.89 28.89,27.94 28.89,24.45 | 9.53,41.91 10.16,42.55 v10.16,45.09 11.43,46.35 12.7,46.35 18.1,51.75 18.1,54.93 18.73,55.56 v19.37,55.56 | 9.53,41.91 7.94,40.32 | v10.48,33 9.53,33.95 9.53,38.73 | 7.94,40.32 9.53,38.73 | 7.94,40.32 SPI-BI-WIRE.4 | 28.89,24.45 28.26,23.81 | 28.26,23.81 v29.53,23.81 28.89,24.45 | 9.53,38.73 9.53,41.91
  pour Top: 56.83,31.11 57.47,30.48 57.47,31.75
  pour Top: 56.83,41.27 57.47,41.91 57.47,40.64
  pour Top: 56.83,51.75 57.47,52.39 57.47,51.12
  pour Bottom: 28.89,24.45 29.53,23.81 28.26,23.81
  pour Top: 29.53,23.81 30.8,23.81 30.16,23.18
  pour Top: 10.48,33.02 10.79,33.02 11.43,32.38 9.84,32.38
  pour Bottom: 7.94,40.32 9.53,41.91 9.53,38.73
+5V  (via drill 0.35)
  Top 0.254: U$2.P1 10.48,68.26 10.79,67.94 10.79,67.31 10.48,66.99 8.26,66.99 7.94,66.67 C19.1 7.94,60.96 9.84,59.05 9.84,57.47 10.79,56.52 C9.1 13.34,54.92 13.97,54.29 14.92,54.29 15.24,53.98 15.24,52.7 15.88,52.07 25.4,52.07 26.04,52.7 26.04,55.56 | 25.4,56.2 26.04,55.56 | 25.4,56.2 C1.1 | IC2.3 23.81,59.63 | LED1.A LED2.A 47.62,74.3 48.26,73.66 48.26,69.85 47.62,69.22 47.01,69.22 L1.1 46.99,67.31 46.35,66.67 37.47,66.67 36.83,66.04 36.83,64.45 35.88,63.5 35.88,61.91 36.51,61.28 36.51,60.01 34.92,58.42 28.89,58.42 28.26,57.78 28.26,56.83 27.62,56.2 26.67,56.2 | 25.4,56.2 26.67,56.2 | 26.04,55.56 26.67,56.2
  Top 0.508: X1.1 19.38,70.18 20.64,68.92 v20.64,68.58 | 23.81,59.63 v23.81,57.78 23.81,56.51 C1.1
  Bottom 0.508: v20.64,68.58 20.64,66.67 23.81,63.5 v23.81,57.78
  pour Top: 25.4,56.2 26.67,56.2 26.04,55.56
A1
  Top 0.254: IC8.3 38.73,27.3 38.42,26.99 R1.2 37.47,25.4 37.15,25.71 25.99,25.71 U$1.1
A2
  Top 0.254: IC9.3 38.73,38.1 38.42,37.78 R2.2 38.1,35.88 36.83,35.88 36.2,35.24 36.2,27.62 34.92,26.35 26.06,26.35 U$1.2
A3
  Top 0.254: IC3.3 38.73,48.9 38.42,48.58 R3.2 36.52,46.99 36.51,46.99 36.2,46.99 35.56,46.35 35.56,27.94 34.61,26.99 26.13,26.99 U$1.3
A4
  Top 0.254: IC4.3 38.73,59.69 38.42,59.37 R4.2 36.51,57.78 34.92,56.2 34.92,28.26 34.29,27.62 26.2,27.62 U$1.4
D+  (via drill 0.35)
  Top 0.254: R6.1 13.02,65.72 v13.65,65.09 | v7.3,68.26 U$2.P5
  Top 0.508: X1.3 17.78,69.53 17.14,68.9 16.19,68.9 15.24,67.94 13.34,67.94 11.75,66.36 R6.1
  Bottom 0.254: v13.65,65.09 10.48,68.26 v7.3,68.26
D-  (via drill 0.35)
  Top 0.254: U$2.P3 11.06,69.26 v11.75,68.58 | v17.46,66.36 16.82,65.72 R5.1
  Top 0.508: X1.2 18.58,68.75 17.78,67.94 16.83,67.94 15.56,66.67 R5.1
  Bottom 0.254: v11.75,68.58 11.75,68.26 14.29,65.72 16.83,65.72 v17.46,66.36
GND  (via drill 0.2, 0.2 pad 0.5, 0.2 pad 0.55, 0.35)
  Top 0.254: C1.2 C2.2 18.73,54.3 18.1,54.93 v18.1,56.52 C9.2 | 19.33,59.38 16.19,59.38 C3.2 C4.2 | 7.03,69.26 U$2.P4 | 7.03,69.26 6.04,68.27 C19.2 4.13,65.09 3.14,64.1 RESET.3 | v15.56,69.85 7.62,69.85 7.03,69.26 | C18.2 12.74,47.62 | v24.13,72.71 28.12,72.71 IC1.7 29.84,72.72 30.48,72.07 30.48,70.48 31.17,69.8 33.79,69.8 34.1,70.11 IC1.18 37.09,70.11 37.78,70.8 C8.2 40.32,70.8 40.64,70.48 40.64,69.22 40.95,68.9 C6.2 | C15.2 C14.2 28.33,36.51 27.92,36.51 U$1.19 26.01,38.42 25.4,38.42 24.45,37.47 24.13,37.15 24.13,36.77 U$1.14 26.07,34.82 C13.2 | C7.2 C6.2 | v13.97,48.9 13.97,48.86 12.74,47.62 | C16.2 32.39,39.69 32.7,39.37 32.7,35.24 C15.2 | 40.96,34.29 IC9.6 44.13,34.29 44.45,34.61 44.45,42.23 44.13,42.55 IC3.8 40.96,42.55 40.64,42.86 40.64,44.13 | 40.96,34.29 40.64,33.97 40.64,33.34 | 40.64,33.34 40.96,33.02 IC9.7 | 40.64,33.34 40.64,32.07 40.96,31.75 IC9.8 44.13,31.75 44.45,31.43 44.45,23.81 44.13,23.5 IC8.6 40.96,23.5 | 40.96,34.29 R2.1 v38.42,32.07 | 40.96,23.5 40.64,23.18 40.64,22.54 | 40.64,22.54 40.96,22.23 IC8.7 | 40.64,22.54 40.64,21.27 | 40.64,21.27 40.96,20.95 IC8.8 | 40.96,23.5 R1.1 | 40.96,45.09 IC3.6 44.13,45.09 44.45,45.4 44.45,53.02 44.13,53.34 IC4.8 40.96,53.34 40.64,53.66 40.64,54.93 | 40.96,45.09 40.64,44.77 40.64,44.13 | 40.64,44.13 40.96,43.81 IC3.7 | R3.1 40.95,45.09 40.96,45.09 | IC4.6 40.96,55.88 | 40.96,55.88 40.64,55.56 40.64,54.93 | 40.64,54.93 40.96,54.61 IC4.7 | R4.1 40.95,55.88 40.96,55.88 | 12.74,47.62 13.65,46.71 13.65,45.83 U$1.49 17.14,42.34 | 17.53,39.62 18.1,40.19 18.1,41.38 17.14,42.34 | 17.53,39.62 U$1.68 12.52,34.61 v11.75,34.61 | C17.2 9.88,29.88
  Top 0.254: v39.05,8.89 39.05,8.26 39.69,7.62 41.91,7.62 42.55,8.26 42.55,19.68 42.23,20 40.96,20 40.64,20.32 | 40.64,20.32 40.64,21.27 | v33.97,19.37 33.97,20.95 33.34,21.59 C10.2 | C15.2 32.78,32.07 v33.66,32.07 | IC1.25 36.56,74.67 36.83,74.93 36.45,75.31 IC1.26 34.36,75.31 33.66,74.61 33.66,72.71 | IC1.21 34.3,72.06 33.66,72.71 | v18.41,40.01 18.03,39.62 17.53,39.62 | v17.14,42.55 17.14,42.34 | v40.64,19.68 40.64,20.32 | v35.56,65.41 35.56,66.04 36.83,67.31 41.27,67.31 41.91,67.94 C6.2 | v32.07,73.03 33.34,73.03 33.66,72.71
  Top 0.406: C11.2 10.47,23.5 v8.57,25.4 8.57,28.57 v8.83,28.83 9.88,29.88 | v17.46,8.26 IC5.8 17.46,12.38 18.1,13.02 | v28.26,8.89 IC6.8 28.26,12.38 27.62,13.02 | v39.05,8.89 IC7.8 39.05,12.38 38.42,13.02 27.62,13.02 | 18.1,13.02 27.62,13.02 | SPI-BI-WIRE.1 6.03,31.75 6.03,24.13 7.3,22.86 7.3,13.65 7.94,13.02 18.1,13.02 | v20.95,24.77 21.27,24.45 C5.2 22.23,20.64 v22.23,19.37
  Top 0.508: X1.4 X1.5 16.18,71.09 15.56,70.47 v15.56,69.85 | 19.33,59.38 IC2.1 19.33,57.75 v18.1,56.52
  Bottom 0.254: RESET.3 RESET.4 | v15.56,69.85 15.56,72.07 16.19,72.71 v24.13,72.71 v24.13,78.11 v29.21,78.11 30.48,76.83 v30.48,75.56 30.48,74.61 v32.07,73.03 32.7,72.39 36.83,72.39 37.15,72.07 37.15,67.63 35.56,66.04 v35.56,65.41 | v18.1,56.52 17.46,55.88 17.46,52.39 v15.24,50.16 v13.97,48.9 | v11.75,34.61 12.38,33.97 12.38,32.38 10.79,30.8 8.57,30.8 6.99,32.38 SPI-BI-WIRE.1 6.99,30.67 v8.83,28.83 | v33.66,32.07 v38.42,32.07 | v19.05,67.94 19.37,67.94 | v19.05,62.55 19.37,62.55 | v39.05,8.89 39.05,12.38 38.42,13.02 34.92,13.02 33.97,13.97 v33.97,19.37 | v18.41,24.77 19.05,24.77 | v10.79,24.77 11.43,24.77
  Bottom 0.406: v28.26,8.89 28.26,13.02 27.3,13.97 23.18,13.97 22.23,14.92 v22.23,19.37 | v8.57,25.4 9.21,24.77 11.43,24.77 v13.97,24.77 19.05,24.77 v20.95,24.77
  Bottom 0.508: v18.1,56.52 19.37,57.78 19.37,62.55 19.37,67.94 17.46,69.85 v15.56,69.85
  other vias: 49.53,78.11 50.8,75.56 46.99,78.11 44.45,78.11 41.91,78.11 39.37,78.11 36.83,78.11 34.29,78.11 26.67,78.11 22.86,75.56 11.43,78.11 8.89,78.11 10.16,75.56 12.7,75.56 11.43,73.03 8.89,73.03 12.7,70.48 10.16,70.48 7.62,70.48 5.08,70.48 2.54,70.48 3.81,67.94 20.32,70.48 22.86,70.48 31.43,71.12 49.53,73.03 52.07,73.03 50.8,70.48 53.34,70.48 55.88,70.48 58.42,70.48 49.53,67.94 52.07,67.94 54.61,67.94 57.15,67.94 23.81,68.58 2.54,65.41 10.16,66.04 25.4,66.99 27.94,65.41 30.48,65.41 33.02,65.41 38.1,65.41 40.64,65.41 43.18,65.41 45.72,65.41 48.26,65.41 50.8,65.41 53.34,65.41 55.88,65.41 58.42,65.41 57.15,62.87 54.61,63.18 52.07,63.18 46.99,63.82 41.91,63.82 39.37,62.87 36.83,62.87 21.59,62.55 8.89,62.87 3.81,62.87 5.08,60.33 6.99,60.01 17.78,61.59 25.4,60.33 27.94,60.33 35.56,60.33 38.1,60.33 45.72,60.33 52.07,60.01 58.42,60.33 6.35,57.78 8.89,57.78 26.67,57.78 31.75,57.47 34.29,57.47 5.08,55.24 10.16,55.24 11.59,55.24 16.51,55.24 27.94,55.24 31.11,55.24 58.42,55.24 3.81,52.7 6.35,52.7 8.89,52.7 11.43,52.7 13.97,52.7 16.51,53.34 19.68,53.02 26.99,52.7 31.75,52.7 5.08,50.16 10.16,50.16 12.7,50.16 20.32,50.16 22.86,50.16 25.4,50.16 27.94,50.16 30.48,50.16 38.1,50.16 58.42,50.16 6.35,47.62 8.89,47.62 19.68,47.94 24.13,47.62 36.51,48.26 2.54,45.09 7.62,45.09 18.41,45.09 20.95,45.09 31.11,45.09 36.51,44.45 58.42,45.09 6.35,42.55 14.61,42.55 19.68,42.55 22.23,42.55 27.3,42.55 29.84,42.55 32.38,42.55 2.54,40.01 11.11,39.37 13.34,40.01 15.88,40.01 20.95,40.01 23.5,40.01 26.04,40.01 28.57,40.01 33.66,40.01 36.51,40.01 38.1,40.01 58.42,40.01 2.54,34.92 16.51,34.29 18.41,34.29 20.95,34.29 58.42,34.92 3.49,32.38 2.54,29.84 5.08,29.84 18.41,29.84 20.16,30 38.1,29.84 58.42,29.84 3.81,27.3 2.54,24.77 5.08,24.77 22.86,24.77 25.4,24.77 27.94,24.77 30.48,24.77 33.02,24.77 58.42,24.77 3.81,22.23 6.35,22.23 44.45,22.23 2.54,19.68 5.08,19.68 43.18,19.68 45.72,19.68 48.26,19.68 50.8,19.68 58.42,19.68 57.15,17.14 54.61,17.14 52.07,17.14 49.53,17.14 46.99,17.14 44.45,17.14 41.91,17.14 6.35,17.14 3.81,17.14 2.54,14.61 5.08,14.61 40.64,14.61 43.18,14.61 45.72,14.61 48.26,14.61 50.8,14.61 53.34,14.61 55.88,14.61 58.42,14.61 57.15,12.06 54.61,12.06 52.07,12.06 49.53,12.06 46.99,12.06 44.45,12.06 41.91,12.06 6.35,12.06 3.81,12.06 2.54,9.53 5.08,9.53 7.62,9.53 43.18,9.53 45.72,9.53 48.26,9.53 50.8,9.53 53.34,9.53 55.88,9.53 58.42,9.53 52.07,6.99 49.53,6.99 46.99,6.99 44.45,6.99 41.91,6.99 39.37,6.99 50.8,4.45 48.26,4.45 45.72,4.45 43.18,4.45 40.64,4.45 41.91,1.91 44.45,1.91 46.99,1.91 49.53,1.91 52.07,1.91 8.89,1.91 11.43,1.91 13.97,1.91 16.51,1.91 19.05,1.91 21.59,1.91 26.67,1.91 29.21,1.91 31.75,1.91 34.29,1.91 36.83,1.91 39.37,1.91 51.44,52.39 51.75,41.59 51.44,31.11 52.23,23.18 23.18,31.75 14.29,66.99 27.15,21.11 51.12,29.21 45.88,48.9 45.88,38.1 45.88,27.3 24.13,1.91
  pour Top: -3.81,83.82 69.85,83.82 69.85,-5.08 -3.81,-5.08
  pour Bottom: -10.16,86.36 73.66,86.36 73.66,-10.16 -10.16,-10.16
M1.1
  Top 0.254: IC8.13 50.48,26.04 51.44,25.08 51.44,22.86 52.07,22.23 ROWS.1
M1.2
  Top 0.254: IC8.14 50.16,27.3 52.39,25.08 52.39,24.13 53.02,23.5 55.88,23.5 56.2,23.18 ROWS.2
M1.3
  Top 0.254: IC8.15 49.85,28.57 ROWS.3
M1.4  (via drill 0.35)
  Top 0.254: IC8.12 v50.48,24.77
  Bottom 0.254: v50.48,24.77 51.75,24.77 53.02,23.5 55.88,23.5 56.2,23.81 ROWS.4
M1.5  (via drill 0.35)
  Top 0.254: IC8.1 v40.64,29.84
  Bottom 0.254: v40.64,29.84 40.96,30.16 52.07,30.16 53.02,31.11 56.83,31.11 57.47,30.48 57.47,29.21 56.83,28.57 55.88,28.57 54.61,27.3 ROWS.5
M1.6  (via drill 0.35)
  Top 0.254: IC8.5 v40.64,24.77
  Bottom 0.254: v40.64,24.77 41.27,25.4 49.21,25.4 49.85,26.04 55.88,26.04 56.2,26.35 ROWS.6
M1.7  (via drill 0.35)
  Top 0.254: IC8.2 v40.64,28.57
  Bottom 0.254: ROWS.7 53.02,29.84 51.44,28.26 40.96,28.26 v40.64,28.57
M1.8  (via drill 0.35)
  Top 0.254: IC8.4 v40.64,26.04
  Bottom 0.254: v40.64,26.04 49.21,26.04 49.85,26.67 51.75,26.67 52.39,27.3 52.39,27.94 53.02,28.57 54.93,28.57 ROWS.8
M2.1
  Top 0.254: IC9.13 50.48,36.83 51.44,35.88 51.44,33.02 52.07,32.38 ROWS.9
M2.2
  Top 0.254: IC9.14 50.16,38.1 52.39,35.88 52.39,34.29 53.02,33.66 55.88,33.66 56.2,33.34 ROWS.10
M2.3
  Top 0.254: IC9.15 49.85,39.37 53.66,35.56 ROWS.11
M2.4  (via drill 0.35)
  Top 0.254: IC9.12 v50.48,35.56
  Bottom 0.254: v50.48,35.56 52.39,33.66 55.88,33.66 56.2,33.97 ROWS.12
M2.5  (via drill 0.35)
  Top 0.254: IC9.1 v40.64,40.64
  Bottom 0.254: v40.64,40.64 52.39,40.64 53.02,41.27 56.83,41.27 57.47,40.64 57.47,39.37 56.83,38.73 55.88,38.73 54.61,37.47 ROWS.13
M2.6  (via drill 0.35)
  Top 0.254: IC9.5 v40.64,35.56
  Bottom 0.254: v40.64,35.56 41.59,36.51 50.8,36.51 51.12,36.2 54.93,36.2 ROWS.14
M2.7  (via drill 0.35)
  Top 0.254: IC9.2 v40.64,39.37
  Bottom 0.254: v40.64,39.37 52.39,39.37 53.02,40.01 ROWS.15
M2.8  (via drill 0.35)
  Top 0.254: IC9.4 v40.64,36.83
  Bottom 0.254: v40.64,36.83 40.96,37.15 52.07,37.15 52.39,37.47 52.39,38.42 52.7,38.73 54.93,38.73 ROWS.16
M3.1
  Top 0.254: IC3.13 50.8,47.62 51.44,46.99 51.44,43.5 52.07,42.86 52.08,42.87 SV2.1
M3.2
  Top 0.254: IC3.14 50.48,48.9 52.07,47.31 52.07,44.45 52.39,44.13 55.88,44.13 56.2,43.81 56.19,43.81 SV2.2
M3.3
  Top 0.254: IC3.15 49.85,50.16 52.7,47.31 52.7,46.35 52.71,46.35 SV2.3
M3.4  (via drill 0.35)
  Top 0.254: IC3.12 v50.48,46.35
  Bottom 0.254: v50.48,46.35 52.7,44.13 55.88,44.13 56.2,44.45 SV2.4
M3.5  (via drill 0.35)
  Top 0.254: IC3.1 v40.64,51.44
  Bottom 0.254: v40.64,51.44 52.39,51.44 52.7,51.75 56.83,51.75 57.47,51.12 57.47,49.85 56.83,49.21 55.56,49.21 54.93,48.58 54.28,48.58 53.66,47.96 SV2.5
M3.6  (via drill 0.35)
  Top 0.254: IC3.5 v40.64,46.35
  Bottom 0.254: v40.64,46.35 41.27,46.99 49.53,46.99 49.85,47.31 51.12,47.31 51.75,46.67 55.56,46.67 56.2,47.31 SV2.6
M3.7  (via drill 0.35)
  Top 0.254: IC3.2 v40.64,50.16
  Bottom 0.254: v40.64,50.16 53.33,50.16 53.64,50.48 SV2.7
M3.8  (via drill 0.35)
  Top 0.254: IC3.4 v40.64,47.62
  Bottom 0.254: v40.64,47.62 48.9,47.62 49.21,47.94 51.44,47.94 52.7,49.21 54.28,49.21 55.56,50.49 55.56,50.48 SV2.8
M4.1
  Top 0.254: IC4.13 50.48,58.42 51.44,57.47 51.44,53.66 52.07,53.02 52.08,53.03 SV2.9
M4.2
  Top 0.254: IC4.14 49.85,59.69 52.07,57.47 52.07,54.61 52.39,54.29 55.88,54.29 56.2,53.98 SV2.10
M4.3
  Top 0.254: IC4.15 50.16,60.96 50.8,60.33 50.8,59.37 52.7,57.47 52.7,56.52 SV2.11
M4.4  (via drill 0.35)
  Top 0.254: IC4.12 v50.48,57.15
  Bottom 0.254: v50.48,57.15 51.44,56.2 51.44,54.93 52.07,54.29 55.88,54.29 56.2,54.61 SV2.12
M4.5  (via drill 0.35)
  Top 0.254: IC4.1 v40.64,62.23
  Bottom 0.254: v40.64,62.23 56.52,62.23 57.47,61.28 57.47,60.01 56.83,59.37 55.56,59.37 54.29,58.1 SV2.13
M4.6  (via drill 0.35)
  Top 0.254: IC4.5 v40.64,57.15
  Bottom 0.254: v40.64,57.15 41.59,58.1 51.44,58.1 52.7,56.83 55.88,56.83 56.2,57.15 SV2.14
M4.7  (via drill 0.35)
  Top 0.254: IC4.2 v40.64,60.96
  Bottom 0.254: v40.64,60.96 41.27,61.59 52.7,61.59 SV2.15
M4.8  (via drill 0.35)
  Top 0.254: IC4.4 v40.64,58.42
  Bottom 0.254: v40.64,58.42 40.96,58.74 52.39,58.74 53.02,59.37 54.6,59.37 55.87,60.65 55.88,60.64 SV2.16
N1
  Top 0.254: L1.2 46.69,70.8 C7.1 C6.1 41.91,72.07 41.27,72.71 38.73,72.71 38.1,72.07 38.1,71.75 37.47,71.12 36.83,71.12 36.53,71.42 IC1.20 35.35,71.44 32.38,71.44 29.16,74.67 IC1.4
N$2
  Top 0.254: R7.2 LED1.C
N$3
  Top 0.254: R8.1 39.05,74.3 37.47,72.71 35.38,72.71 IC1.22
N$5
  Top 0.254: C16.1 30.8,37.47 28.89,37.47 28.57,37.15 27.99,37.15 U$1.20
N$6
  Top 0.254: R7.1 38.42,76.83 38.1,76.52 38.1,73.98 37.47,73.34 35.4,73.34 IC1.23
N$7
  Top 0.254: R8.2 LED2.C
N$9  (via drill 0.35)
  Top 0.254: IC1.1 25.5,76.61 v25.08,76.2
  Bottom 0.254: v25.08,76.2 25.08,72.07 24.61,71.6 24.61,65.25 26.35,63.5 27.94,63.5 28.26,63.18 TX.1
N$10  (via drill 0.35)
  Top 0.254: IC1.5 26.39,74.02 v26.04,73.66
  Bottom 0.254: v26.04,73.66 26.04,73.34 26.35,73.03 26.35,65.72 27.62,64.45 32.38,64.45 33.02,63.82 RX.1
N$11
  Top 0.254: C8.1 38.1,68.9 37.53,69.47 IC1.17
OM1  (via drill 0.35)
  Top 0.254: IC4.11 v50.46,55.88 46.67,55.88 45.09,54.29 45.09,45.72 | v50.48,45.09 IC3.11 45.72,45.09 | v50.48,34.29 IC9.11 45.72,34.29 | v50.48,23.5 IC8.11 46.35,23.5 45.09,24.77 45.09,33.66 | 45.09,44.45 45.09,45.72 | 45.09,44.45 45.09,34.92 | 45.09,34.92 45.72,34.29 | 45.09,33.66 45.09,34.92 | 45.09,44.45 45.72,45.09 | v28.26,48.1 28.26,44.69 U$1.25 | 45.72,45.09 45.09,45.72 | 45.72,34.29 45.09,33.66
  Bottom 0.254: v50.46,55.88 49.67,55.09 36.35,55.09 34.77,53.5 34.77,49.37 34.13,48.74 28.89,48.74 v28.26,48.1
  pour Top: 45.09,45.72 45.72,45.09 45.09,44.45
  pour Top: 45.09,34.92 45.72,34.29 45.09,33.66
OM2  (via drill 0.35)
  Top 0.254: v50.48,54.61 IC4.10 47.31,54.61 46.67,53.98 v46.67,46.04 | v50.48,43.81 IC3.10 47.31,43.81 | v50.48,33.02 IC9.10 46.99,33.02 v46.67,33.34 v46.67,24.45 | v50.48,22.23 IC8.10 v46.99,22.23 | v46.67,35.22 46.67,43.18 | 46.67,43.18 47.31,43.81 | v26.67,44.77 26.67,43.81 U$1.26 | 47.31,43.81 47.01,44.11 v46.67,44.11 46.67,43.18
  Bottom 0.254: v50.48,54.61 36.51,54.61 35.24,53.34 35.24,49.21 32.86,46.83 27.78,46.83 27.3,47.31 26.35,47.31 26.04,46.99 26.04,45.4 v26.67,44.77 | v46.99,22.23 46.67,22.54 v46.67,24.45 | v46.67,33.34 46.35,33.66 46.35,34.9 v46.67,35.22 | v46.67,44.11 v46.67,46.04
  pour Top: 46.99,33.02 46.67,32.7 46.67,33.34
  pour Top: 46.67,44.13 46.99,44.13 47.31,43.81 46.67,43.18
OM3  (via drill 0.35)
  Top 0.254: IC4.9 v50.48,53.34 | IC3.9 v50.48,42.55 | IC9.9 v50.48,31.75 | IC8.9 v50.48,20.95 | v26.99,46.35 25.72,45.09 25.72,43.56 U$1.27
  Bottom 0.254: v50.48,53.34 49.69,54.13 36.67,54.13 35.72,53.18 35.72,49.05 33.02,46.35 | v50.48,42.55 40.01,42.55 | 40.01,42.55 38.73,42.55 | 38.73,42.55 36.2,42.55 33.02,45.72 | v50.48,31.75 40.64,31.75 | 39.37,33.02 39.37,41.91 | 39.37,41.91 38.73,42.55 | 40.64,31.75 39.37,33.02 | 39.37,33.02 39.37,30.48 | 39.37,30.48 39.37,22.23 40.64,20.95 v50.48,20.95 | 33.02,46.35 32.38,46.35 | 32.38,46.35 v26.99,46.35 | 33.02,45.72 32.38,46.35 | 33.02,46.35 33.02,45.72 | 39.37,41.91 40.01,42.55 | 40.64,31.75 39.37,30.48
  pour Bottom: 39.37,41.91 38.73,42.55 40.01,42.55
  pour Bottom: 32.38,46.35 33.02,46.35 33.02,45.72
  pour Bottom: 39.37,33.02 40.64,31.75 39.37,30.48
OS1  (via drill 0.35)
  Top 0.254: U$1.80 15.56,29.16 15.56,20.32 v14.92,19.68
  Top 0.406: IC7.11 v36.51,20 | IC6.11 v25.72,19.68 | IC5.11 v14.92,19.68
  Bottom 0.254: v14.92,19.68 16.19,20.95 23.18,20.95 23.81,20.32 25.08,20.32 | 25.08,20.32 v25.72,19.68 | 25.08,20.32 29.21,20.32 29.84,20.95 34.61,20.95 35.24,20.32 36.2,20.32 v36.51,20
  pour Bottom: 25.72,19.68 26.35,20.32 25.08,20.32
OS2
  Top 0.254: IC5.14 11.11,18.73 11.11,20 12.06,20.95 12.06,27.79 U$1.77
OS3  (via drill 0.35)
  Top 0.254: U$1.79 14.92,29.23 14.92,22.54 v13.65,21.27
  Top 0.406: IC7.12 v35.24,21.59 | IC6.12 v24.45,21.27 | IC5.12 v13.65,21.27
  Bottom 0.254: v13.65,21.27 14.29,21.91 23.81,21.91 | 23.81,21.91 v24.45,21.27 25.08,21.91 | v35.24,21.59 34.92,21.91 25.08,21.91 | 23.81,21.91 25.08,21.91
  pour Bottom: 24.45,21.27 25.08,21.91 23.81,21.91
OS4  (via drill 0.35)
  Top 0.254: IC5.10 v16.19,19.05 16.19,28.89 19.05,31.75 19.05,33.02 19.37,33.34 21.19,33.34 U$1.5 | IC6.10 26.99,19.37 v26.95,19.41 | v37.78,19.05 IC7.10
  Bottom 0.254: v16.19,19.05 17.46,20.32 22.54,20.32 24.13,18.73 26.27,18.73 v26.95,19.41 27.26,19.73 29.57,19.73 30.16,20.32 34.29,20.32 35.88,18.73 37.47,18.73 v37.78,19.05
OS5
  Top 0.254: U$1.78 12.7,27.72 12.7,20.64 12.38,20.32 IC5.13 12.38,15.24 13.02,14.61 22.7,14.61 | 22.7,14.61 23.18,15.08 | IC6.13 23.18,15.08 | 22.7,14.61 23.65,14.61 | 23.65,14.61 33.34,14.61 33.97,15.24 IC7.13 | 23.18,15.08 23.65,14.61
  pour Top: 23.18,15.08 23.65,14.61 22.7,14.61
P3.3  (via drill 0.35)
  Top 0.254: U$1.40 21.54,48.58 v21.59,48.58
  Bottom 0.254: v21.59,48.58 22.23,49.21 32.38,49.21 33.02,49.85 RX.2
P3.4  (via drill 0.35)
  Top 0.254: U$1.41 17.53,47.55 v16.51,48.58
  Bottom 0.254: TX.2 29.84,51.44 29.53,51.12 19.37,51.12 19.05,50.8 19.05,49.85 18.73,49.53 16.83,49.53 16.51,49.21 v16.51,48.58
RST/SBWTDIO  (via drill 0.35)
  Top 0.254: v9.84,26.99 11.39,28.54 C17.1 R16.1 14.36,31.43 15,31.43 U$1.76
  Bottom 0.254: RESET.1 RESET.2 6.27,50.09 4.45,48.26 4.45,38.73 | 4.45,38.73 4.45,36.83 | 4.45,36.83 4.45,31.75 9.21,26.99 v9.84,26.99 | SPI-BI-WIRE.3 5.4,37.78 | 4.45,38.73 5.4,37.78 | 5.4,37.78 4.45,36.83
  pour Bottom: 5.4,37.78 4.45,38.73 4.45,36.83
S1.1  (via drill 0.35)
  Top 0.406: IC5.15 v9.84,19.37
  Bottom 0.406: v9.84,19.37 9.84,6.52 10.33,6.03 COLUMNS.1
S1.2
  Top 0.406: IC5.1 8.57,7.62 8.89,7.3 8.89,3.81 9.37,3.33 10.32,3.33 COLUMNS.2
S1.3
  Top 0.406: IC5.2 9.84,8.57 10.79,7.62 11.75,7.62 13.03,6.34 13.02,6.33 COLUMNS.3
S1.4  (via drill 0.35)
  Top 0.406: IC5.3 v11.11,8.89
  Bottom 0.406: v11.11,8.89 11.11,7.94 11.75,7.3 11.75,3.81 12.22,3.33 12.86,3.33 COLUMNS.4
S1.5
  Top 0.406: IC5.4 12.38,8.57 13.34,7.62 14.29,7.62 15.56,6.34 15.56,6.33 COLUMNS.5
S1.6  (via drill 0.35)
  Top 0.406: IC5.5 v13.65,8.89
  Bottom 0.406: v13.65,8.89 13.65,7.94 14.29,7.3 14.29,3.81 14.76,3.33 15.4,3.33 COLUMNS.6
S1.7
  Top 0.406: IC5.6 14.92,8.57 15.88,7.62 16.83,7.62 18.11,6.34 18.1,6.33 COLUMNS.7
S1.8  (via drill 0.35)
  Top 0.406: IC5.7 v16.19,8.89
  Bottom 0.406: v16.19,8.89 16.19,7.94 16.83,7.3 16.83,3.81 17.3,3.33 17.94,3.33 COLUMNS.8
S2.1  (via drill 0.35)
  Top 0.406: IC6.15 v20.64,19.37
  Bottom 0.406: COLUMNS.9 v20.64,19.37
S2.2
  Top 0.406: IC6.1 19.37,3.81 19.84,3.33 20.48,3.33 COLUMNS.10
S2.3
  Top 0.406: IC6.2 20.64,8.26 21.27,7.62 22.23,7.62 23.18,6.66 23.18,6.65 COLUMNS.11
S2.4  (via drill 0.35)
  Top 0.406: IC6.3 v21.91,8.89
  Bottom 0.406: v21.91,8.89 21.91,3.81 22.38,3.33 23.02,3.33 COLUMNS.12
S2.5
  Top 0.406: IC6.4 23.18,8.26 23.81,7.62 24.77,7.62 25.73,6.66 25.72,6.65 COLUMNS.13
S2.6  (via drill 0.35)
  Top 0.406: IC6.5 v24.45,8.89
  Bottom 0.406: v24.45,8.89 24.45,3.81 24.92,3.33 25.56,3.33 COLUMNS.14
S2.7
  Top 0.406: IC6.6 25.72,8.26 26.35,7.62 27.3,7.62 28.27,6.66 28.26,6.65 COLUMNS.15
S2.8  (via drill 0.35)
  Top 0.406: IC6.7 v26.99,8.89
  Bottom 0.406: v26.99,8.89 26.99,3.81 27.46,3.33 28.1,3.33 COLUMNS.16
S3.1  (via drill 0.35)
  Top 0.406: IC7.15 v31.43,19.37
  Bottom 0.406: v31.43,19.37 31.43,8.89 30.8,8.26 COLUMNS.17
S3.2
  Top 0.406: IC7.1 30.16,9.21 29.53,8.57 29.53,3.81 30,3.33 30.64,3.33 COLUMNS.18
S3.3
  Top 0.406: IC7.2 31.43,8.26 32.07,7.62 33.02,7.62 33.34,7.29 COLUMNS.19
S3.4  (via drill 0.35)
  Top 0.406: IC7.3 v32.7,8.89
  Bottom 0.406: v32.7,8.89 32.07,8.26 32.07,3.81 32.54,3.33 33.18,3.33 COLUMNS.20
S3.5
  Top 0.406: IC7.4 33.97,8.26 34.61,7.62 35.56,7.62 35.88,7.29 COLUMNS.21
S3.6  (via drill 0.35)
  Top 0.406: IC7.5 v35.24,8.89
  Bottom 0.406: v35.24,8.89 34.61,8.26 34.61,3.81 35.08,3.33 35.72,3.33 COLUMNS.22
S3.7
  Top 0.406: IC7.6 36.51,8.26 37.15,7.62 38.1,7.62 38.42,7.29 COLUMNS.23
S3.8  (via drill 0.35)
  Top 0.406: IC7.7 v37.78,8.89
  Bottom 0.406: v37.78,8.89 37.15,8.26 37.15,3.81 37.62,3.33 38.26,3.33 COLUMNS.24
TEST/SBWTCK
  Top 0.254: U$1.71 13.69,33.66 11.11,33.66 9.53,35.24 SPI-BI-WIRE.2
USB_D+
  Top 0.254: IC1.15 33.88,68.17 32.07,66.36 27.3,66.36 26.67,65.72 26.67,64.45 25.72,63.5 17.78,63.5 16.51,62.23 12.3,62.23 | 11.75,62.23 12.3,62.23 | 12.3,62.23 12.3,62.31 11.75,62.87 | 12.3,62.23 12.3,62.15 11.75,61.59
  Top 0.508: R6.2 11.75,62.87 11.75,62.23 11.75,61.59 C4.1
  pour Top: 11.75,62.87 12.38,62.23 11.75,61.59
USB_D-  (via drill 0.35)
  Top 0.254: IC1.16 33.89,68.81 32.07,66.99 26.99,66.99 26.04,66.04 26.04,64.77 25.4,64.14 15.88,64.14 R5.2 v13.65,63.82 | v13.65,60.64 C3.1
  Bottom 0.254: v13.65,63.82 13.02,63.18 13.02,61.28 v13.65,60.64
X0
  Top 0.254: IC5.9 17.46,15.88 18.1,15.24 21.27,15.24 21.91,15.88 IC6.14
X1
  Top 0.254: IC6.9 28.26,15.88 28.89,15.24 32.07,15.24 32.7,15.88 IC7.14

### Text on the board
bPlace: Briseño Medina Mariana / Castro Cárdenas Nestor Manuel / Espinosa Cruz Josué / Mota Morales José Iván / Rocha Evia Carlos Mauricio / Rocha Márquez Samuel Fermín | IB601 | VOLTA 6.0